# EasyEDA Pro project ProPrj_MambaQuad_2026-02-09.epro, schematic Schematic2

## Sheets
1 ESP32: Board Name: MambaRC V1; Create Date: 2026-01-17; Page Name: ESP32; Project Name: MambaQuad; Schematic Name: Schematic2; Update Date: 2026-01-26; BladeWidth: 10; Company: 嘉立创EDA; Page Size: A4; RegionStart: 1; ShowBorder: 1; TitleBlock: 1; TitleBlockPosition: 3; Version: V1.0; XRegionCount: 6; YRegionCount: 4
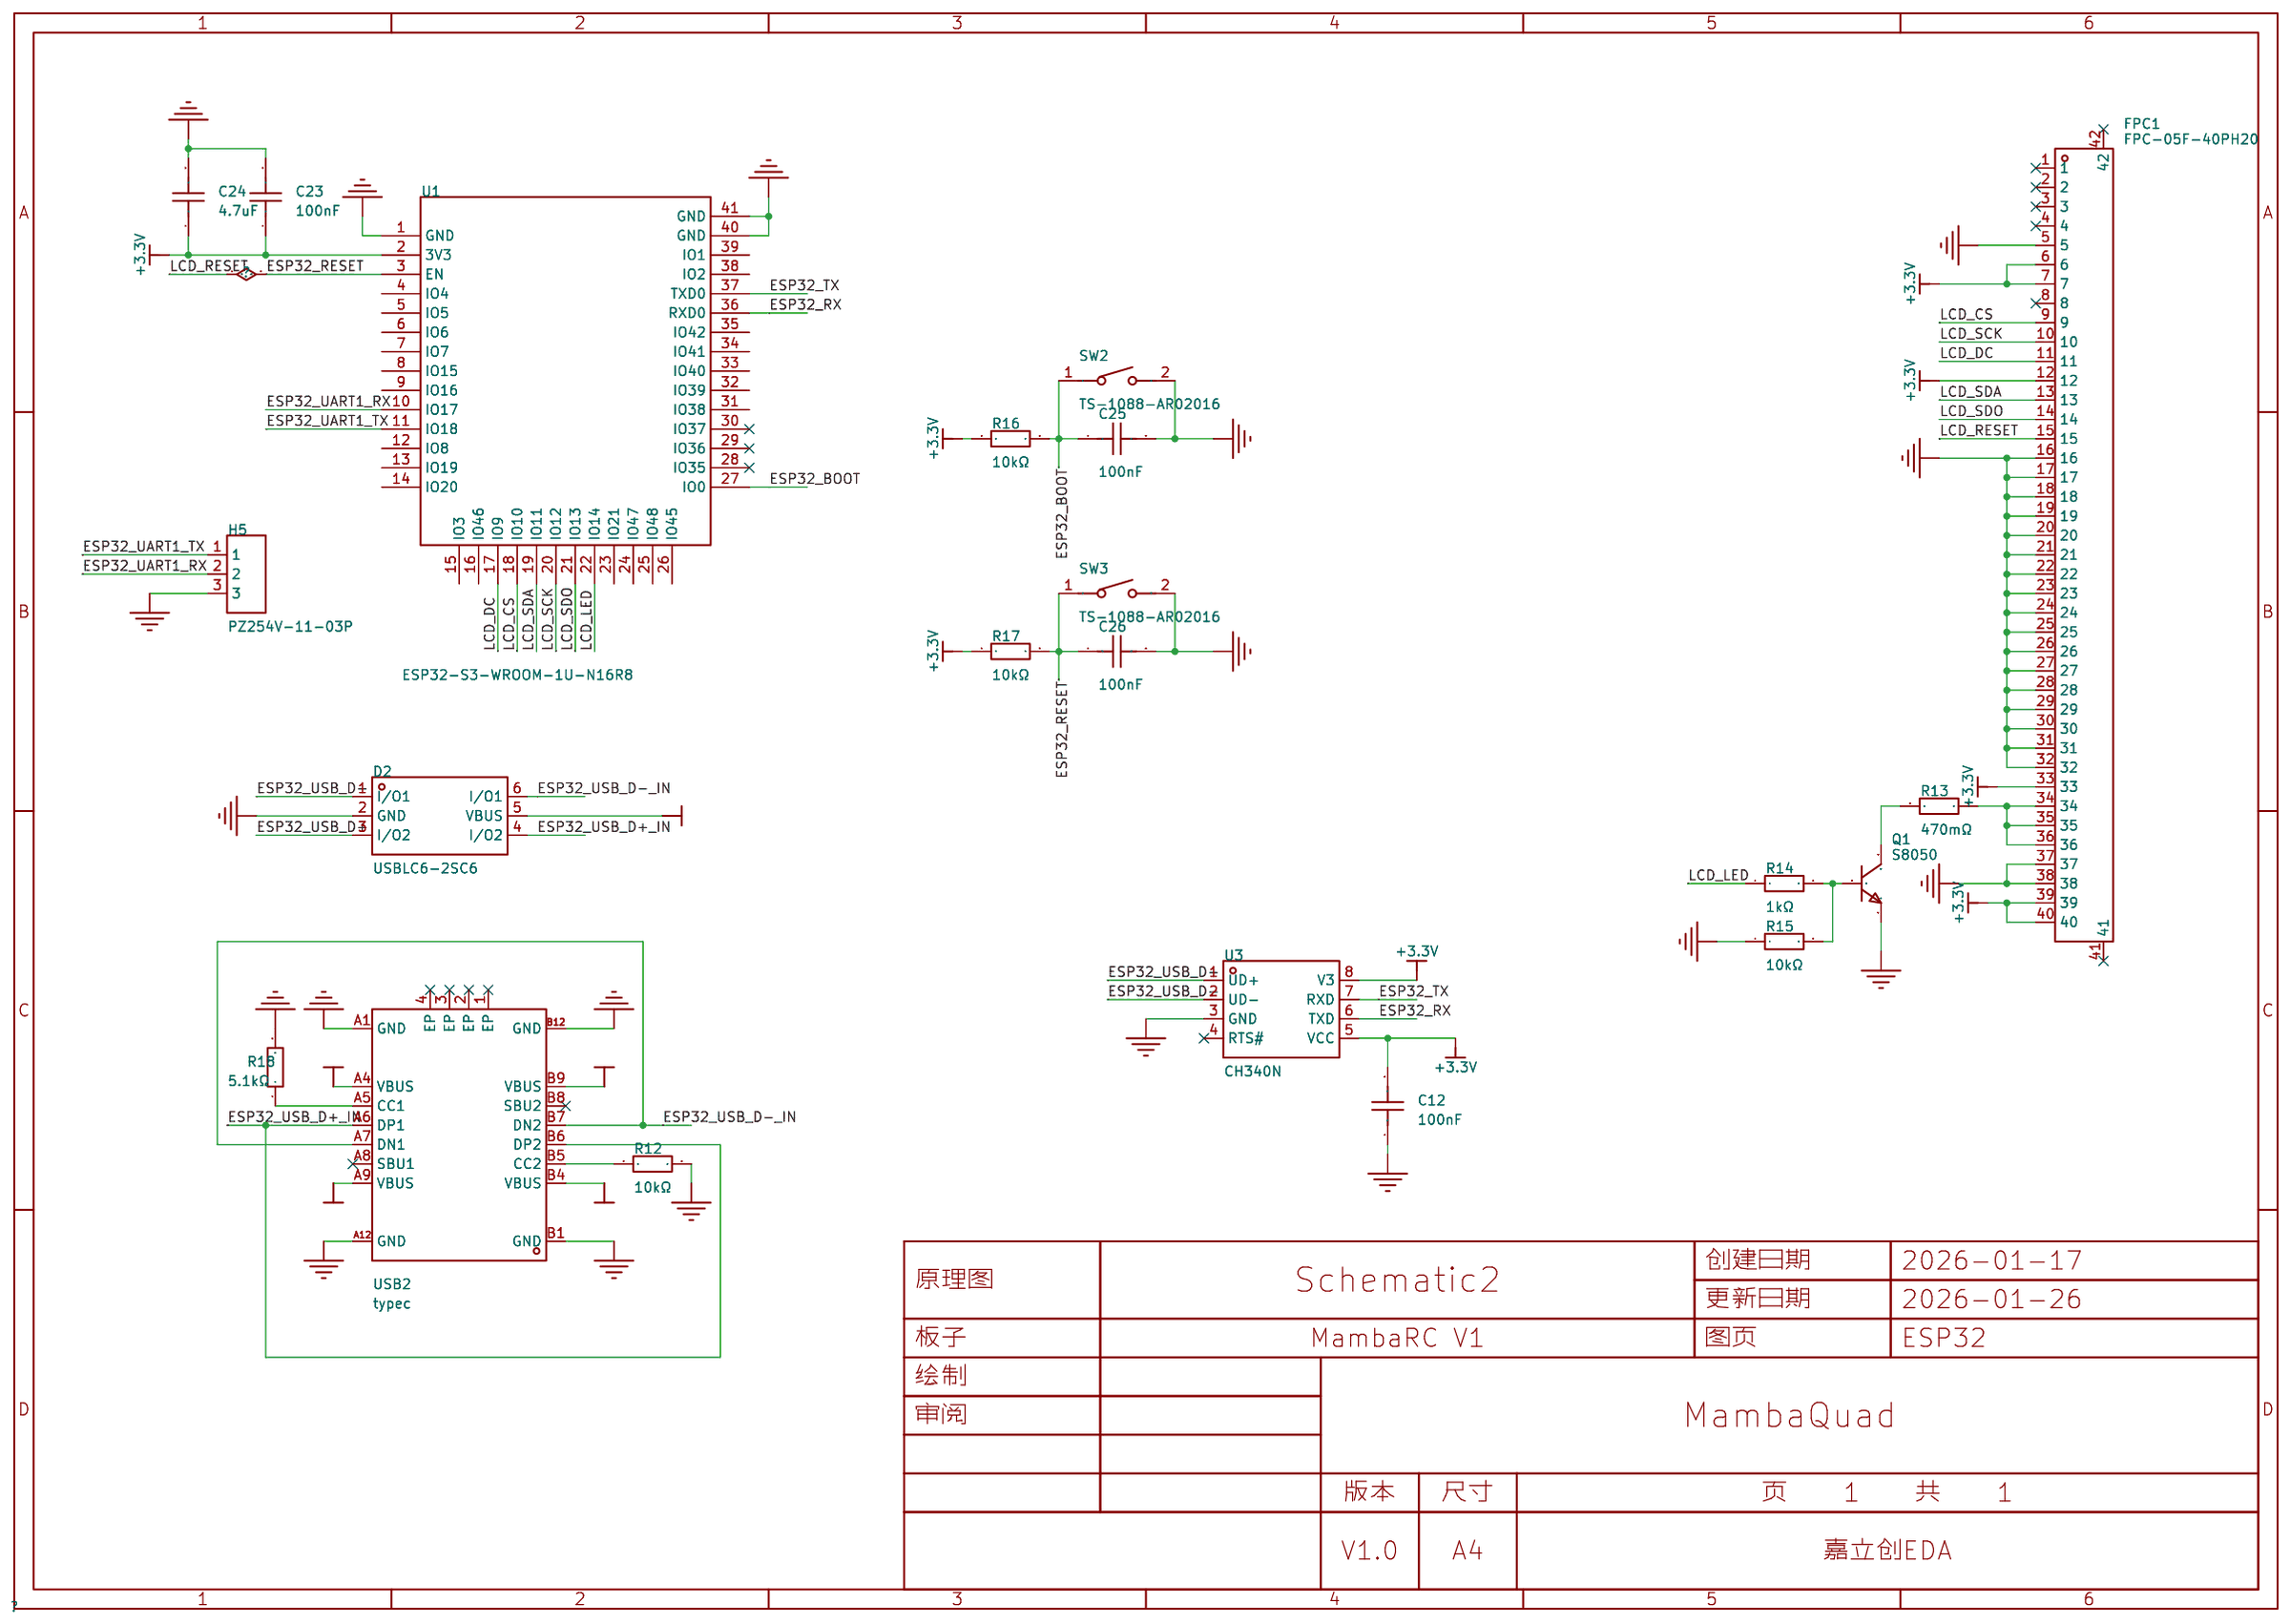
[diagram p0: ESP32]
2 Button: Assembly Variant: Basic; Board Name: Board1; Page Name: P1; Project Name: ManbaController; Schematic Name: Schematic1; Update Date: 2026-01-17
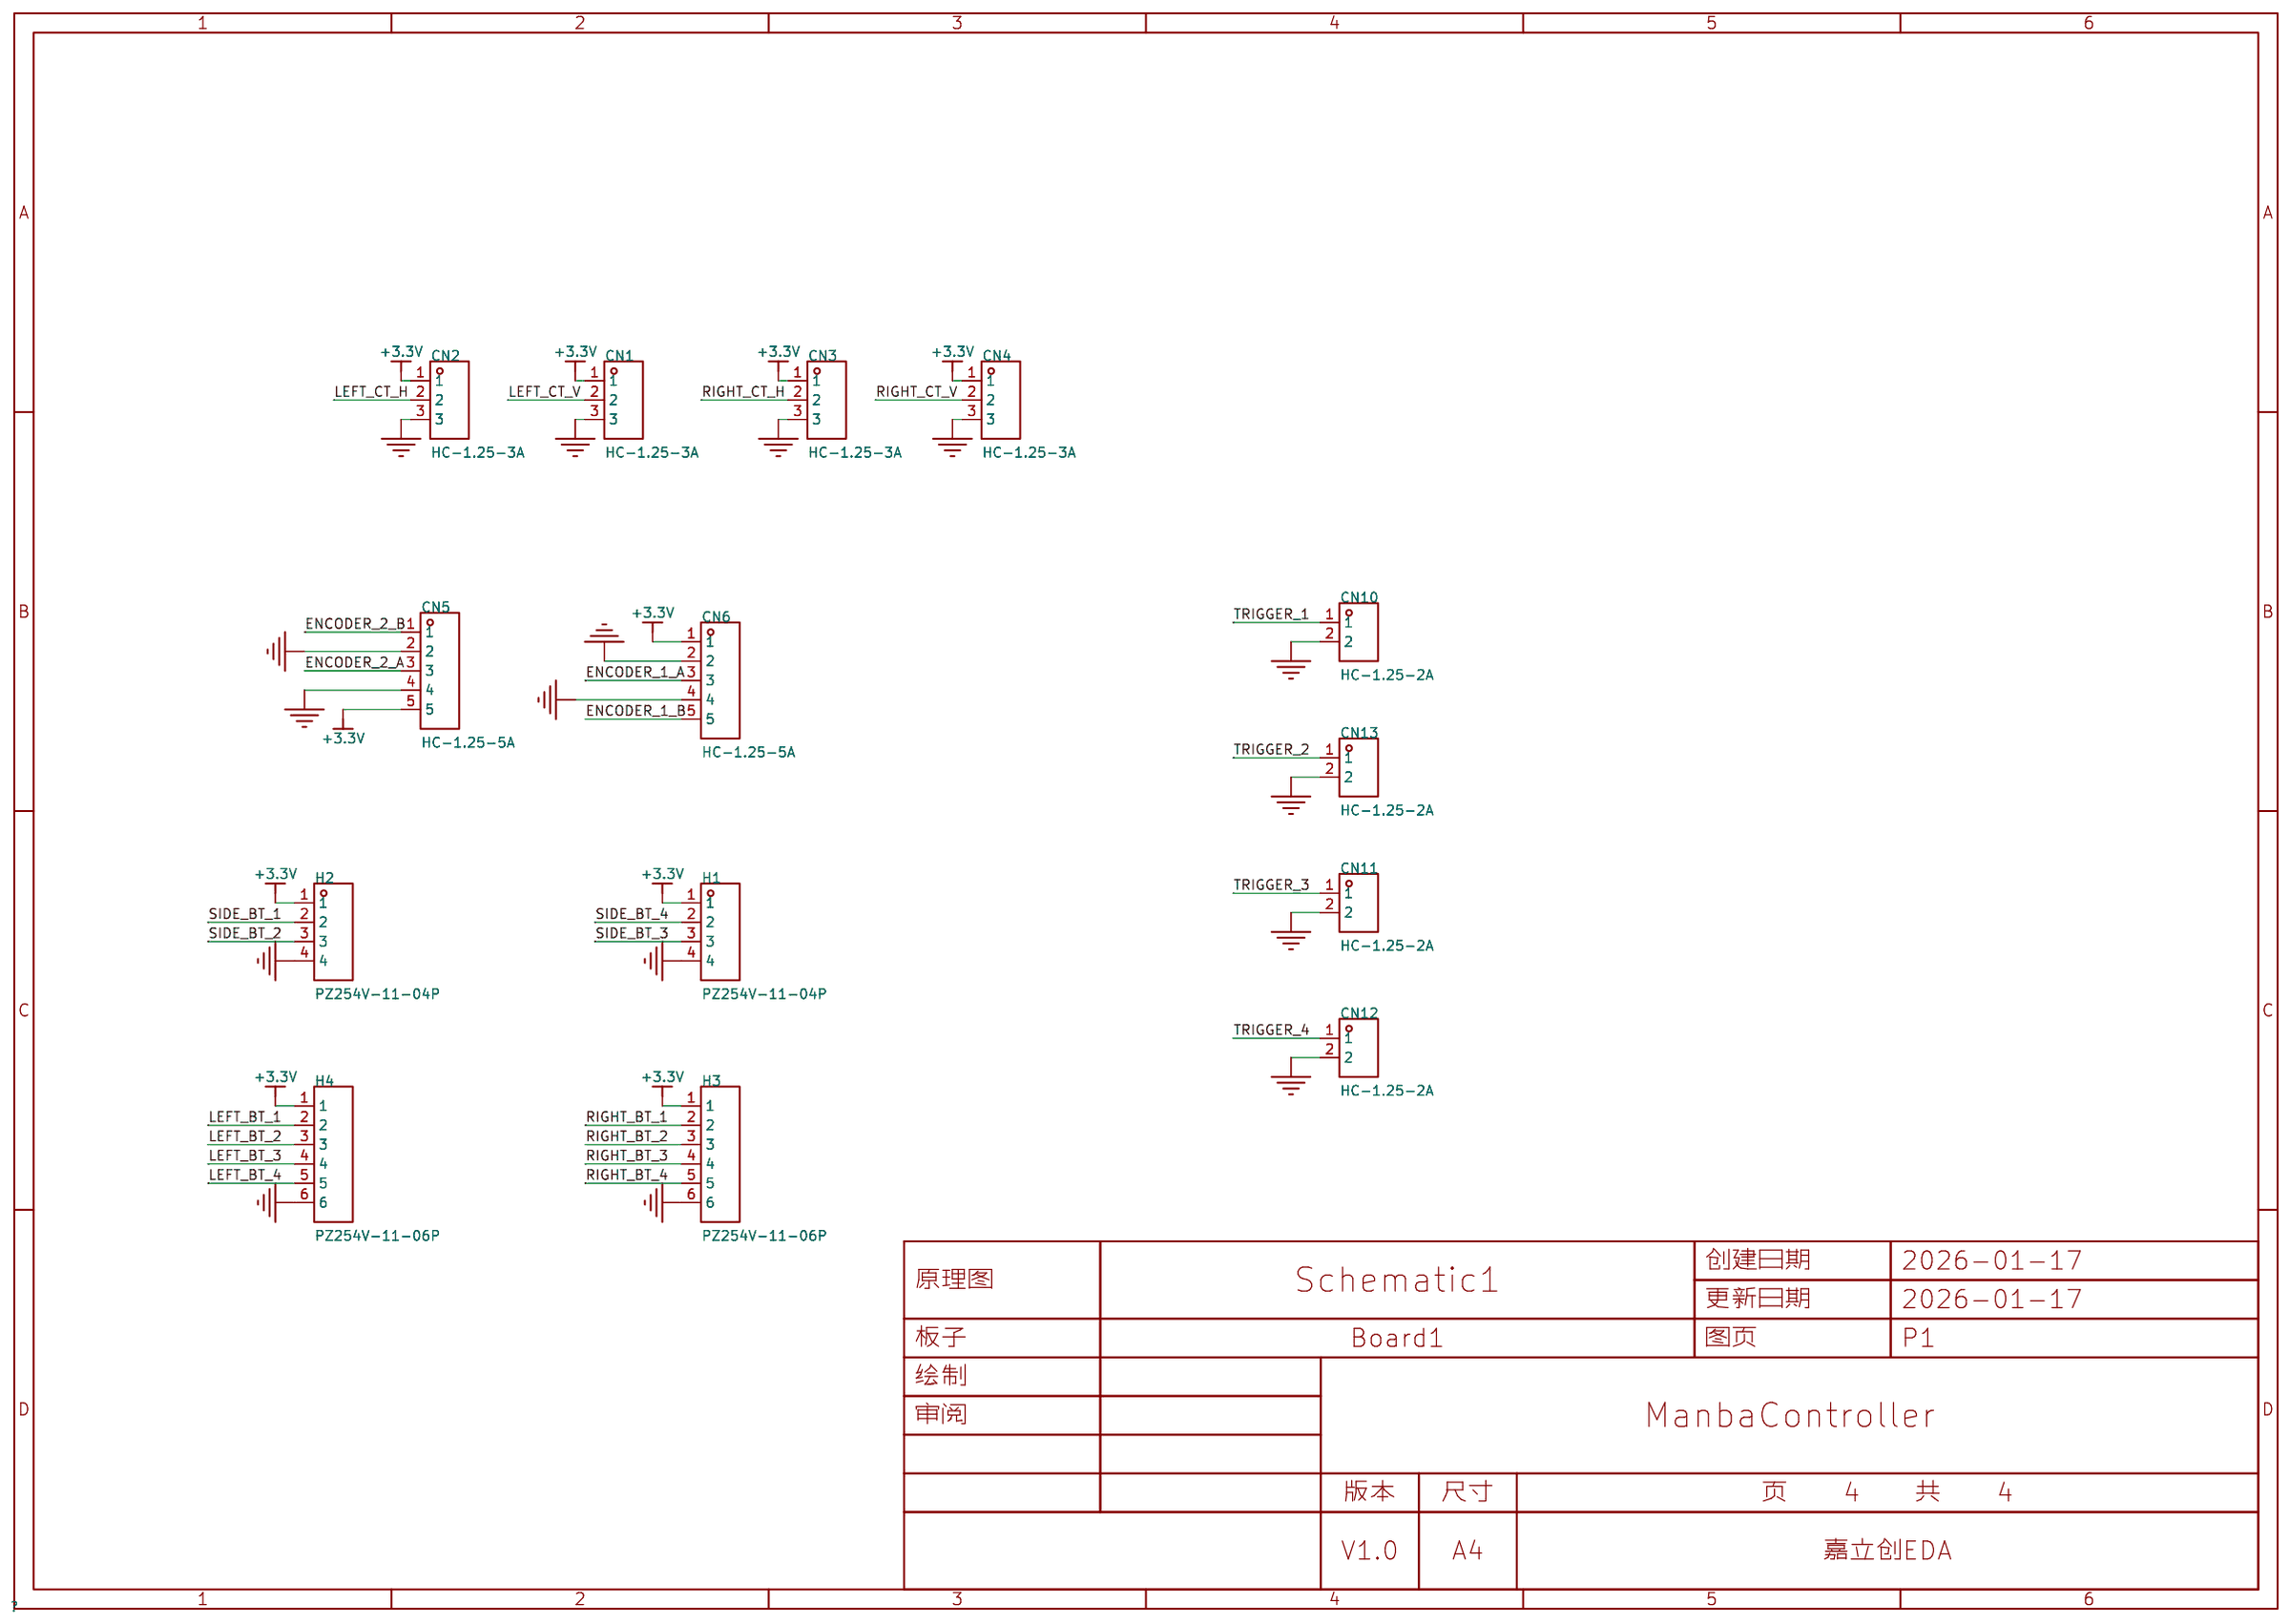
[diagram p1: Button]
3 Sensor: Assembly Variant: Basic; Board Name: Board1; Page Name: P1; Project Name: ManbaController; Schematic Name: Schematic1; Update Date: 2026-01-17
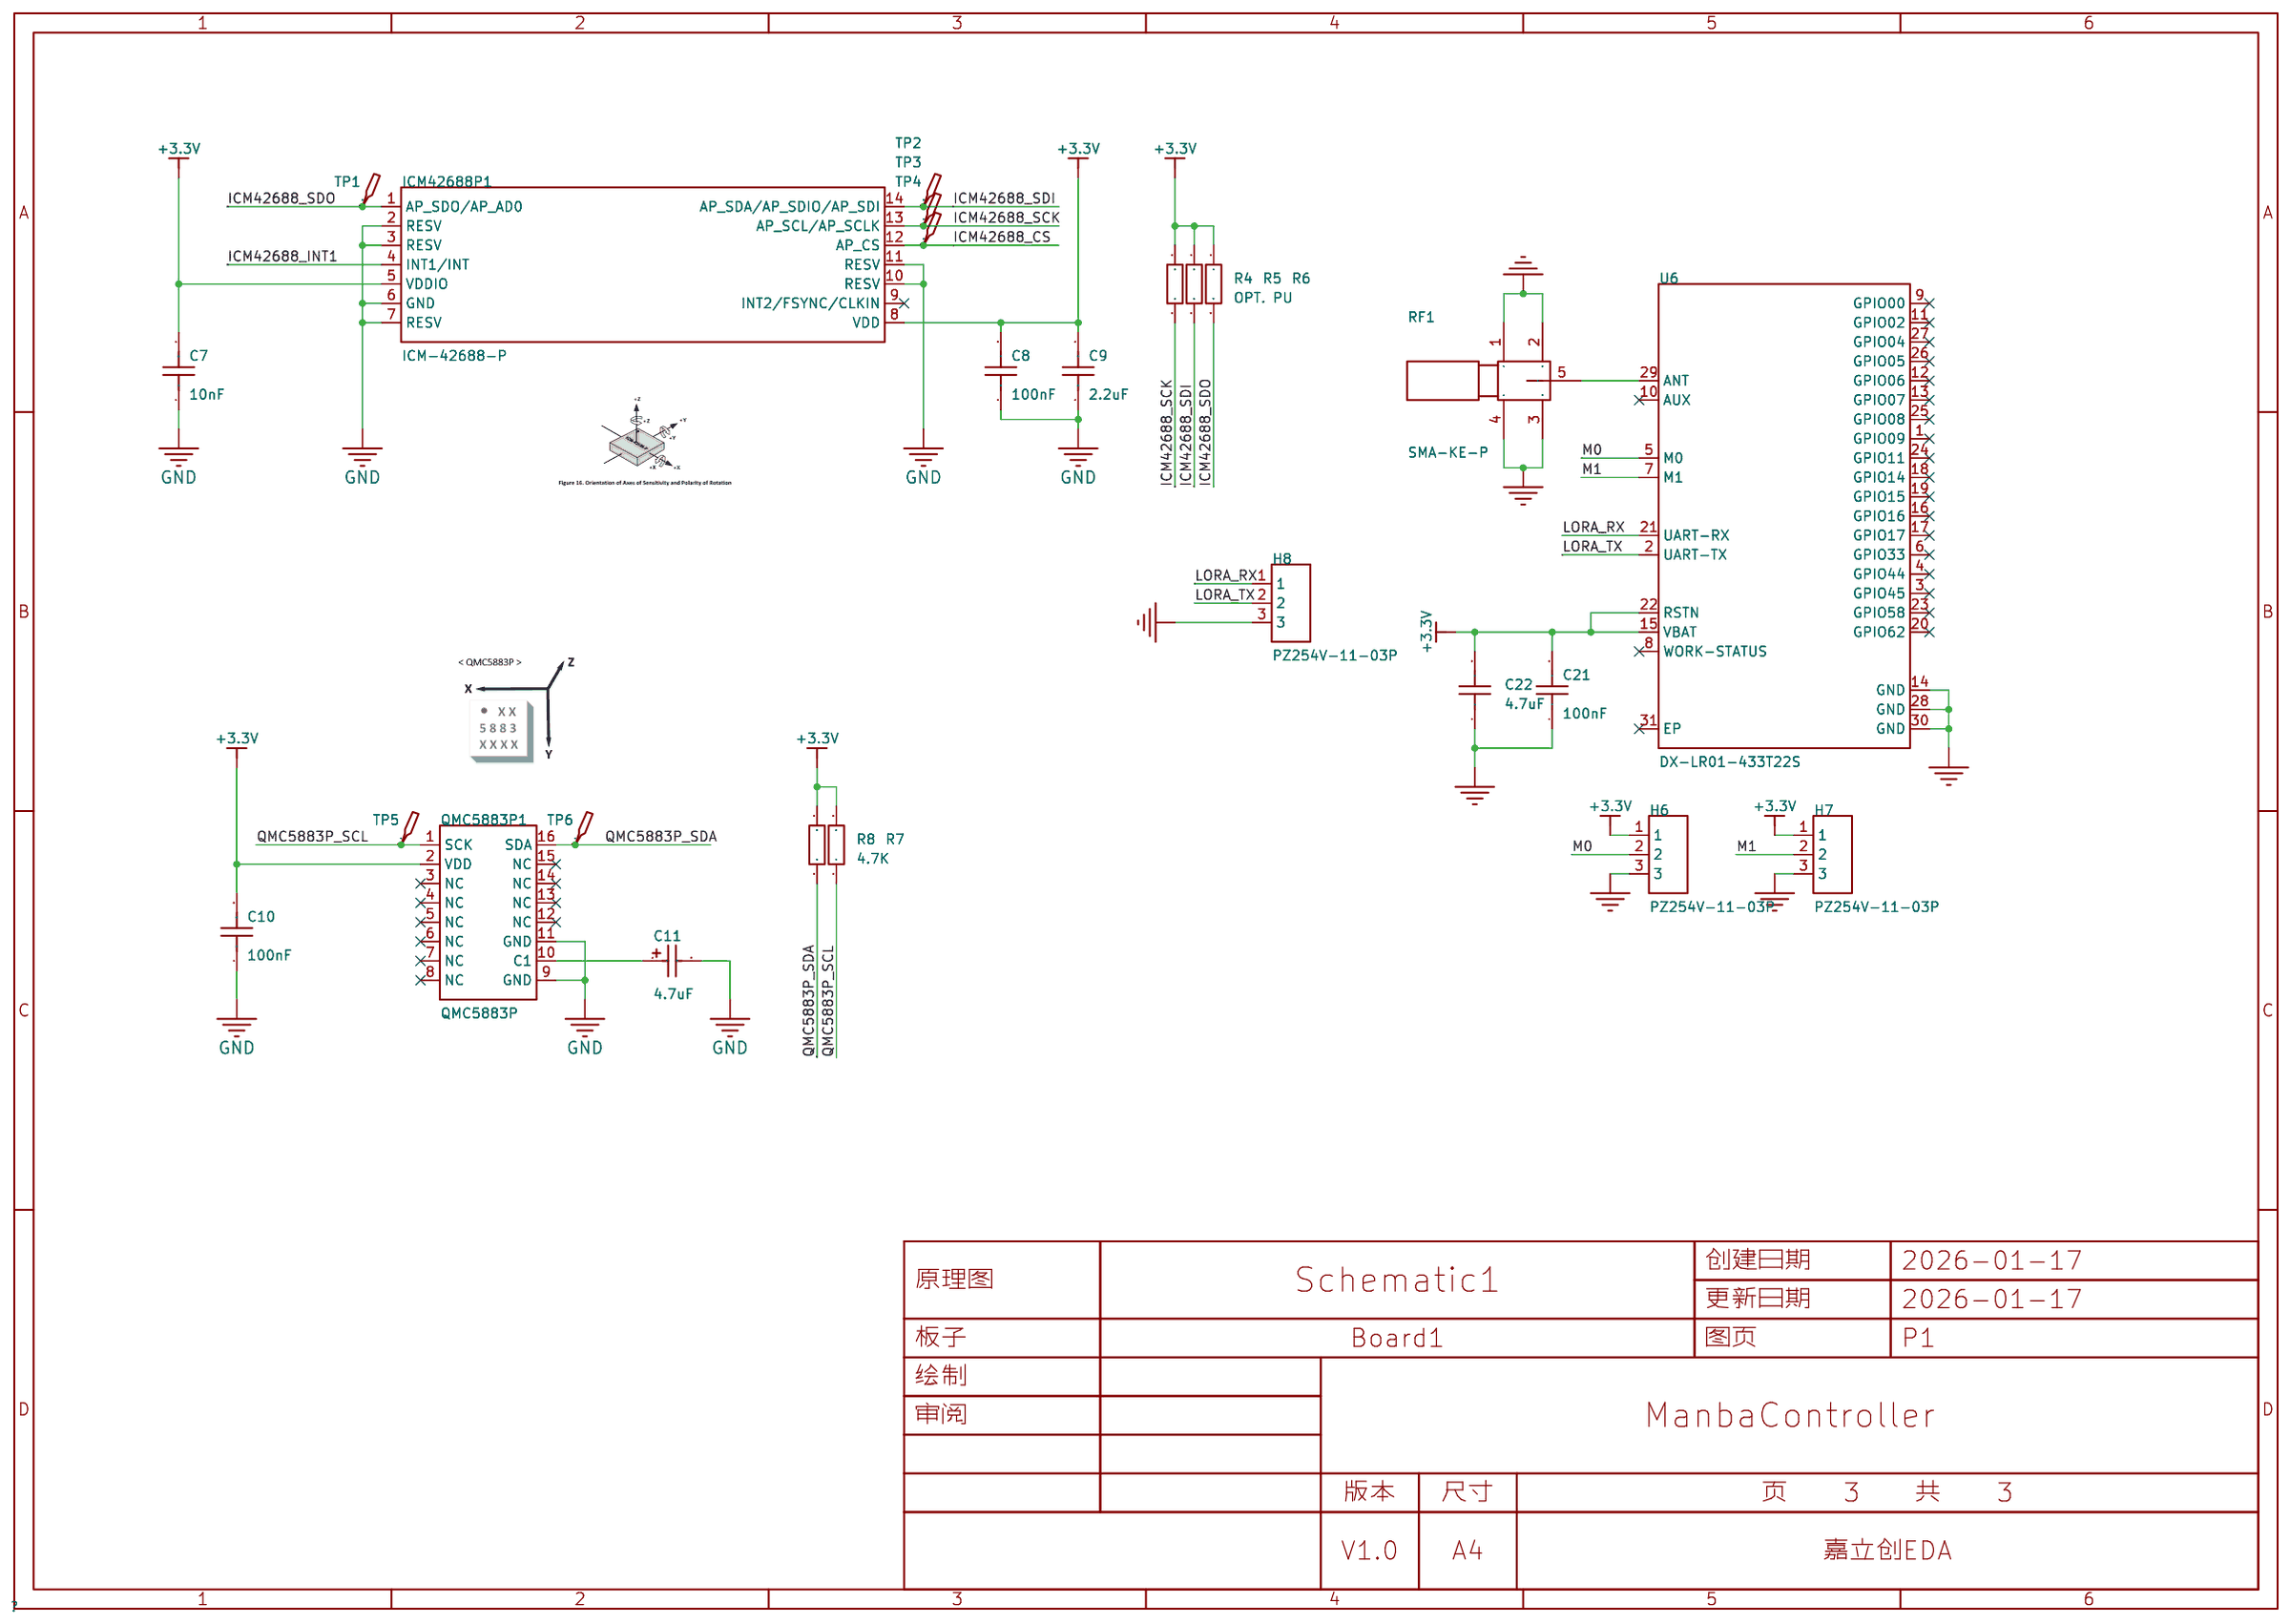
[diagram p2: Sensor]
4 GPS: Assembly Variant: Basic; Board Name: 主控; Create Date: 2026-01-19; Page Name: P1; Project Name: ManbaController; Schematic Name: Schematic1; Update Date: 2026-01-19
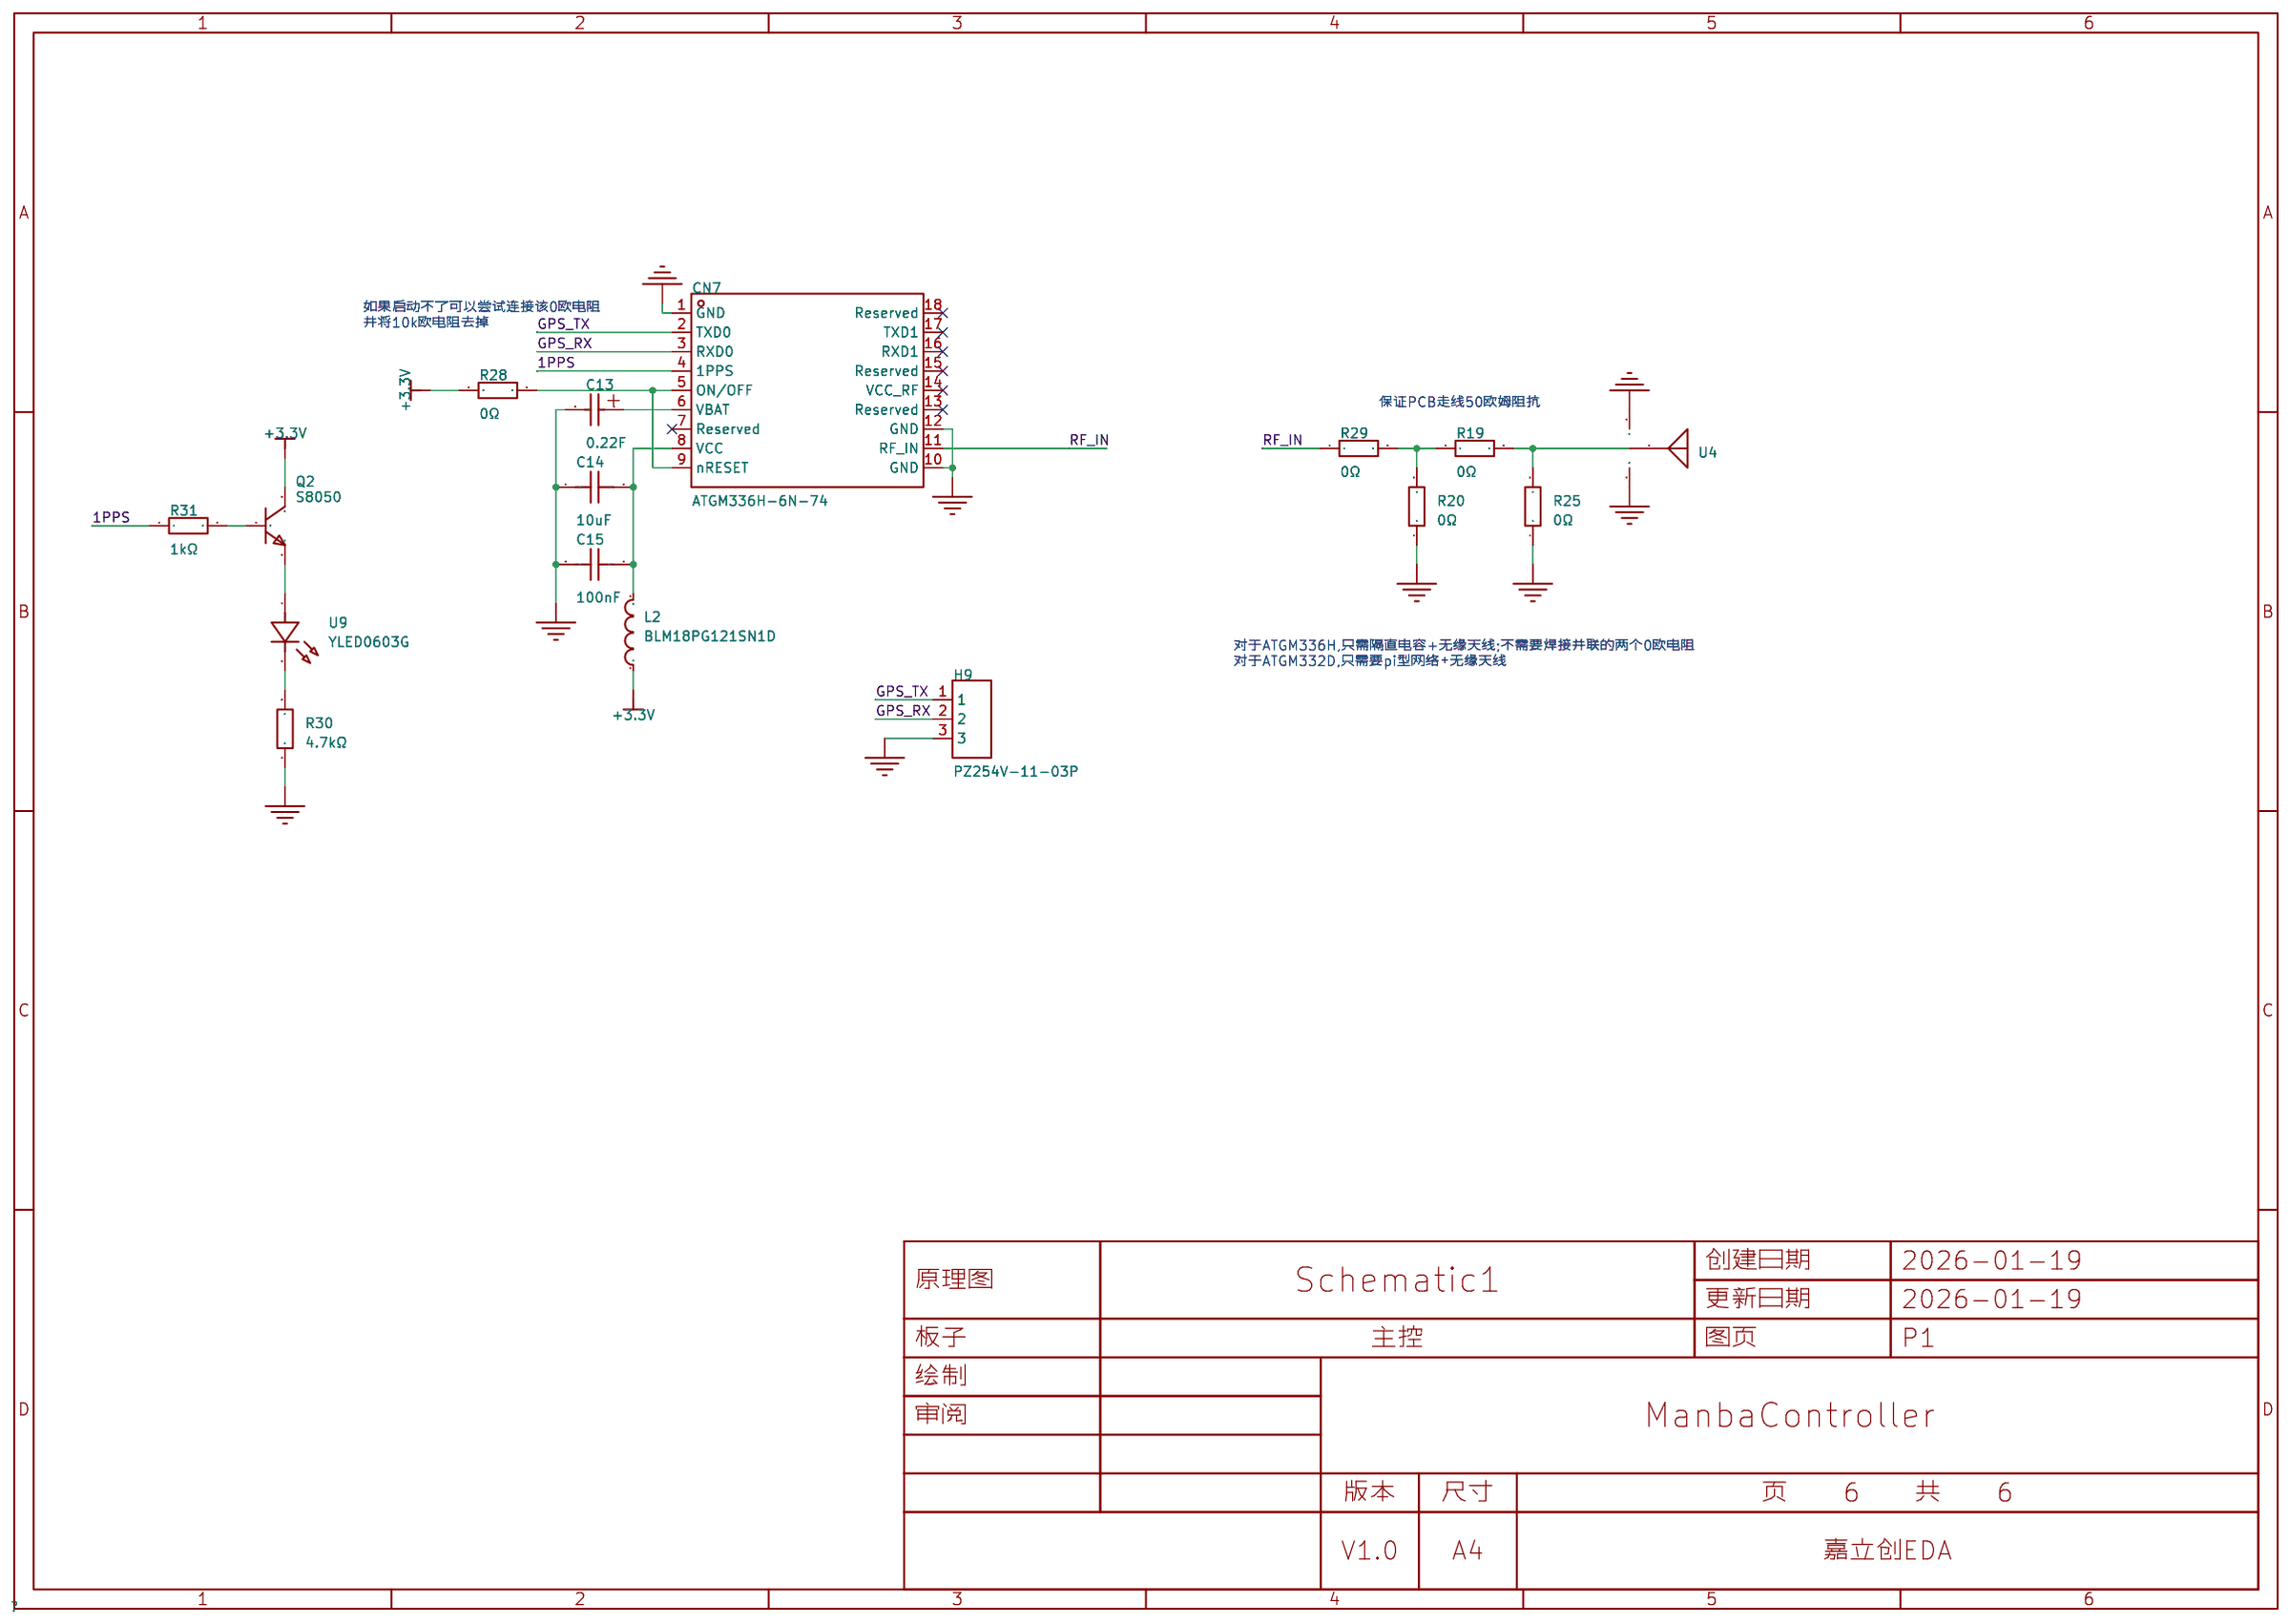
[diagram p3: GPS]
5 Power: Assembly Variant: Basic; Board Name: Board1; Page Name: P1; Project Name: ManbaController; Schematic Name: Schematic1; Update Date: 2026-01-17
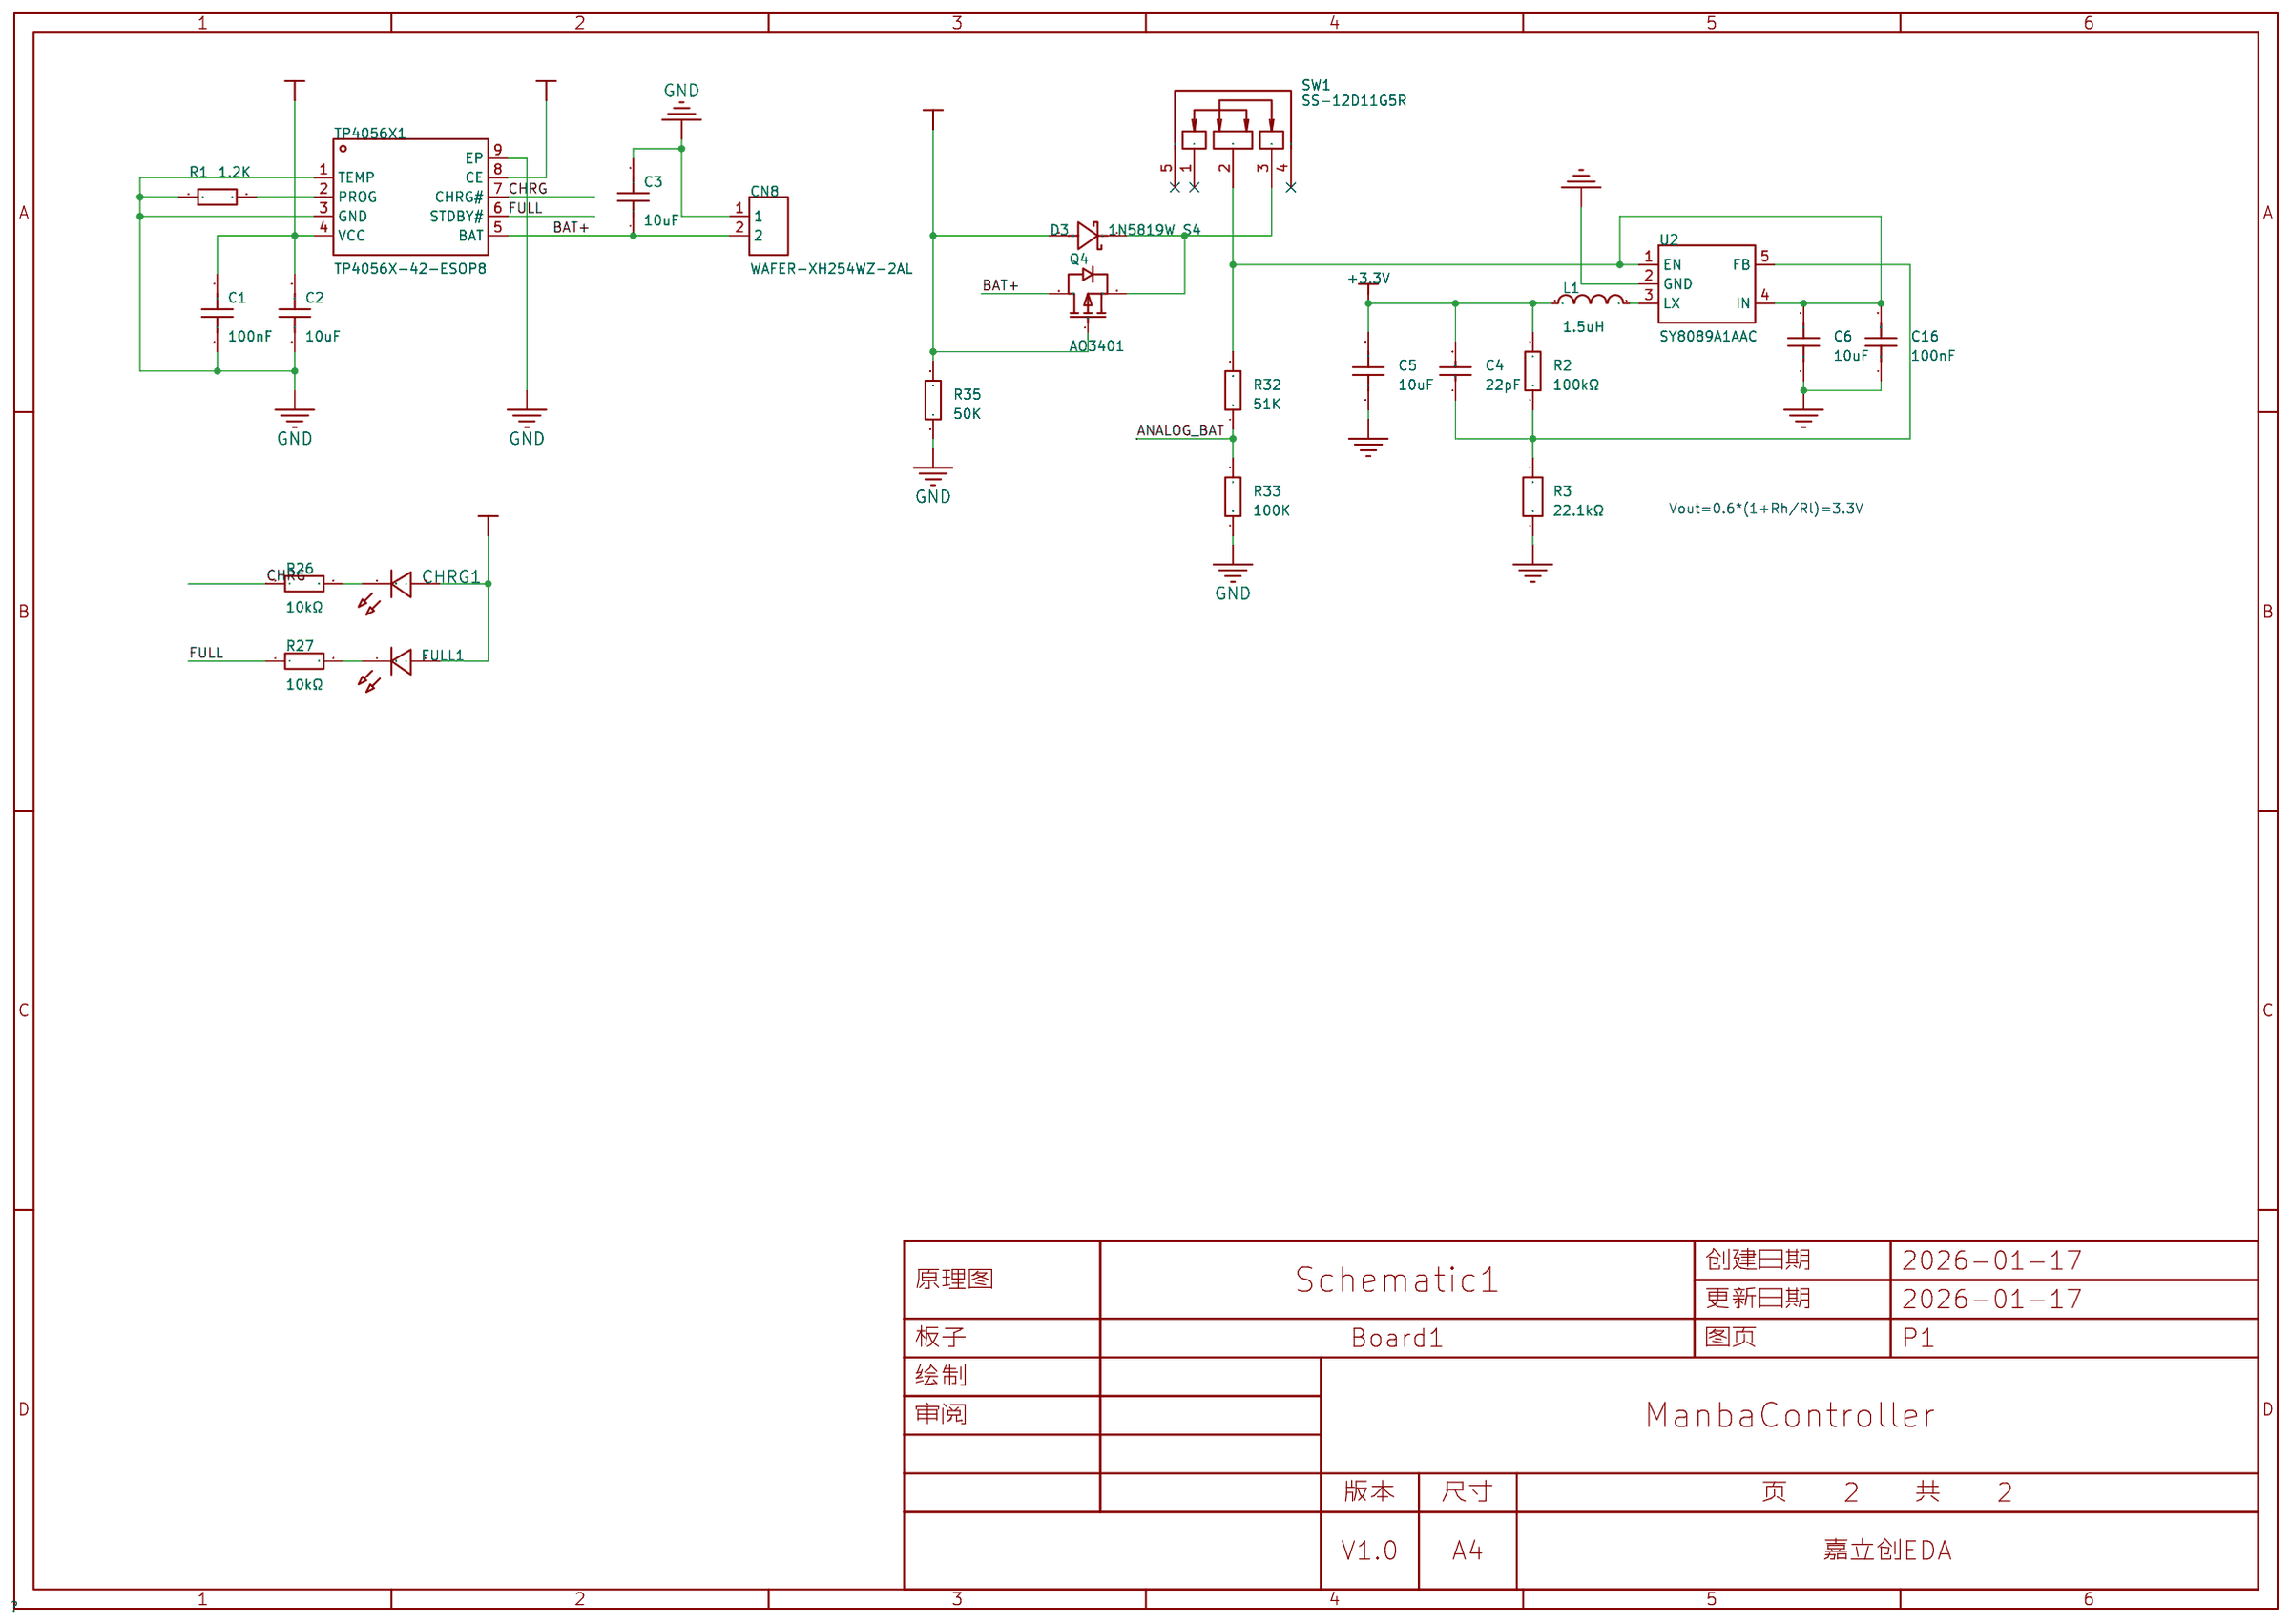
[diagram p4: Power]
6 STM32F103RCT6: Assembly Variant: Basic; Board Name: 主控; Page Name: P1; Project Name: ManbaController; Schematic Name: Schematic1; Update Date: 2026-01-17
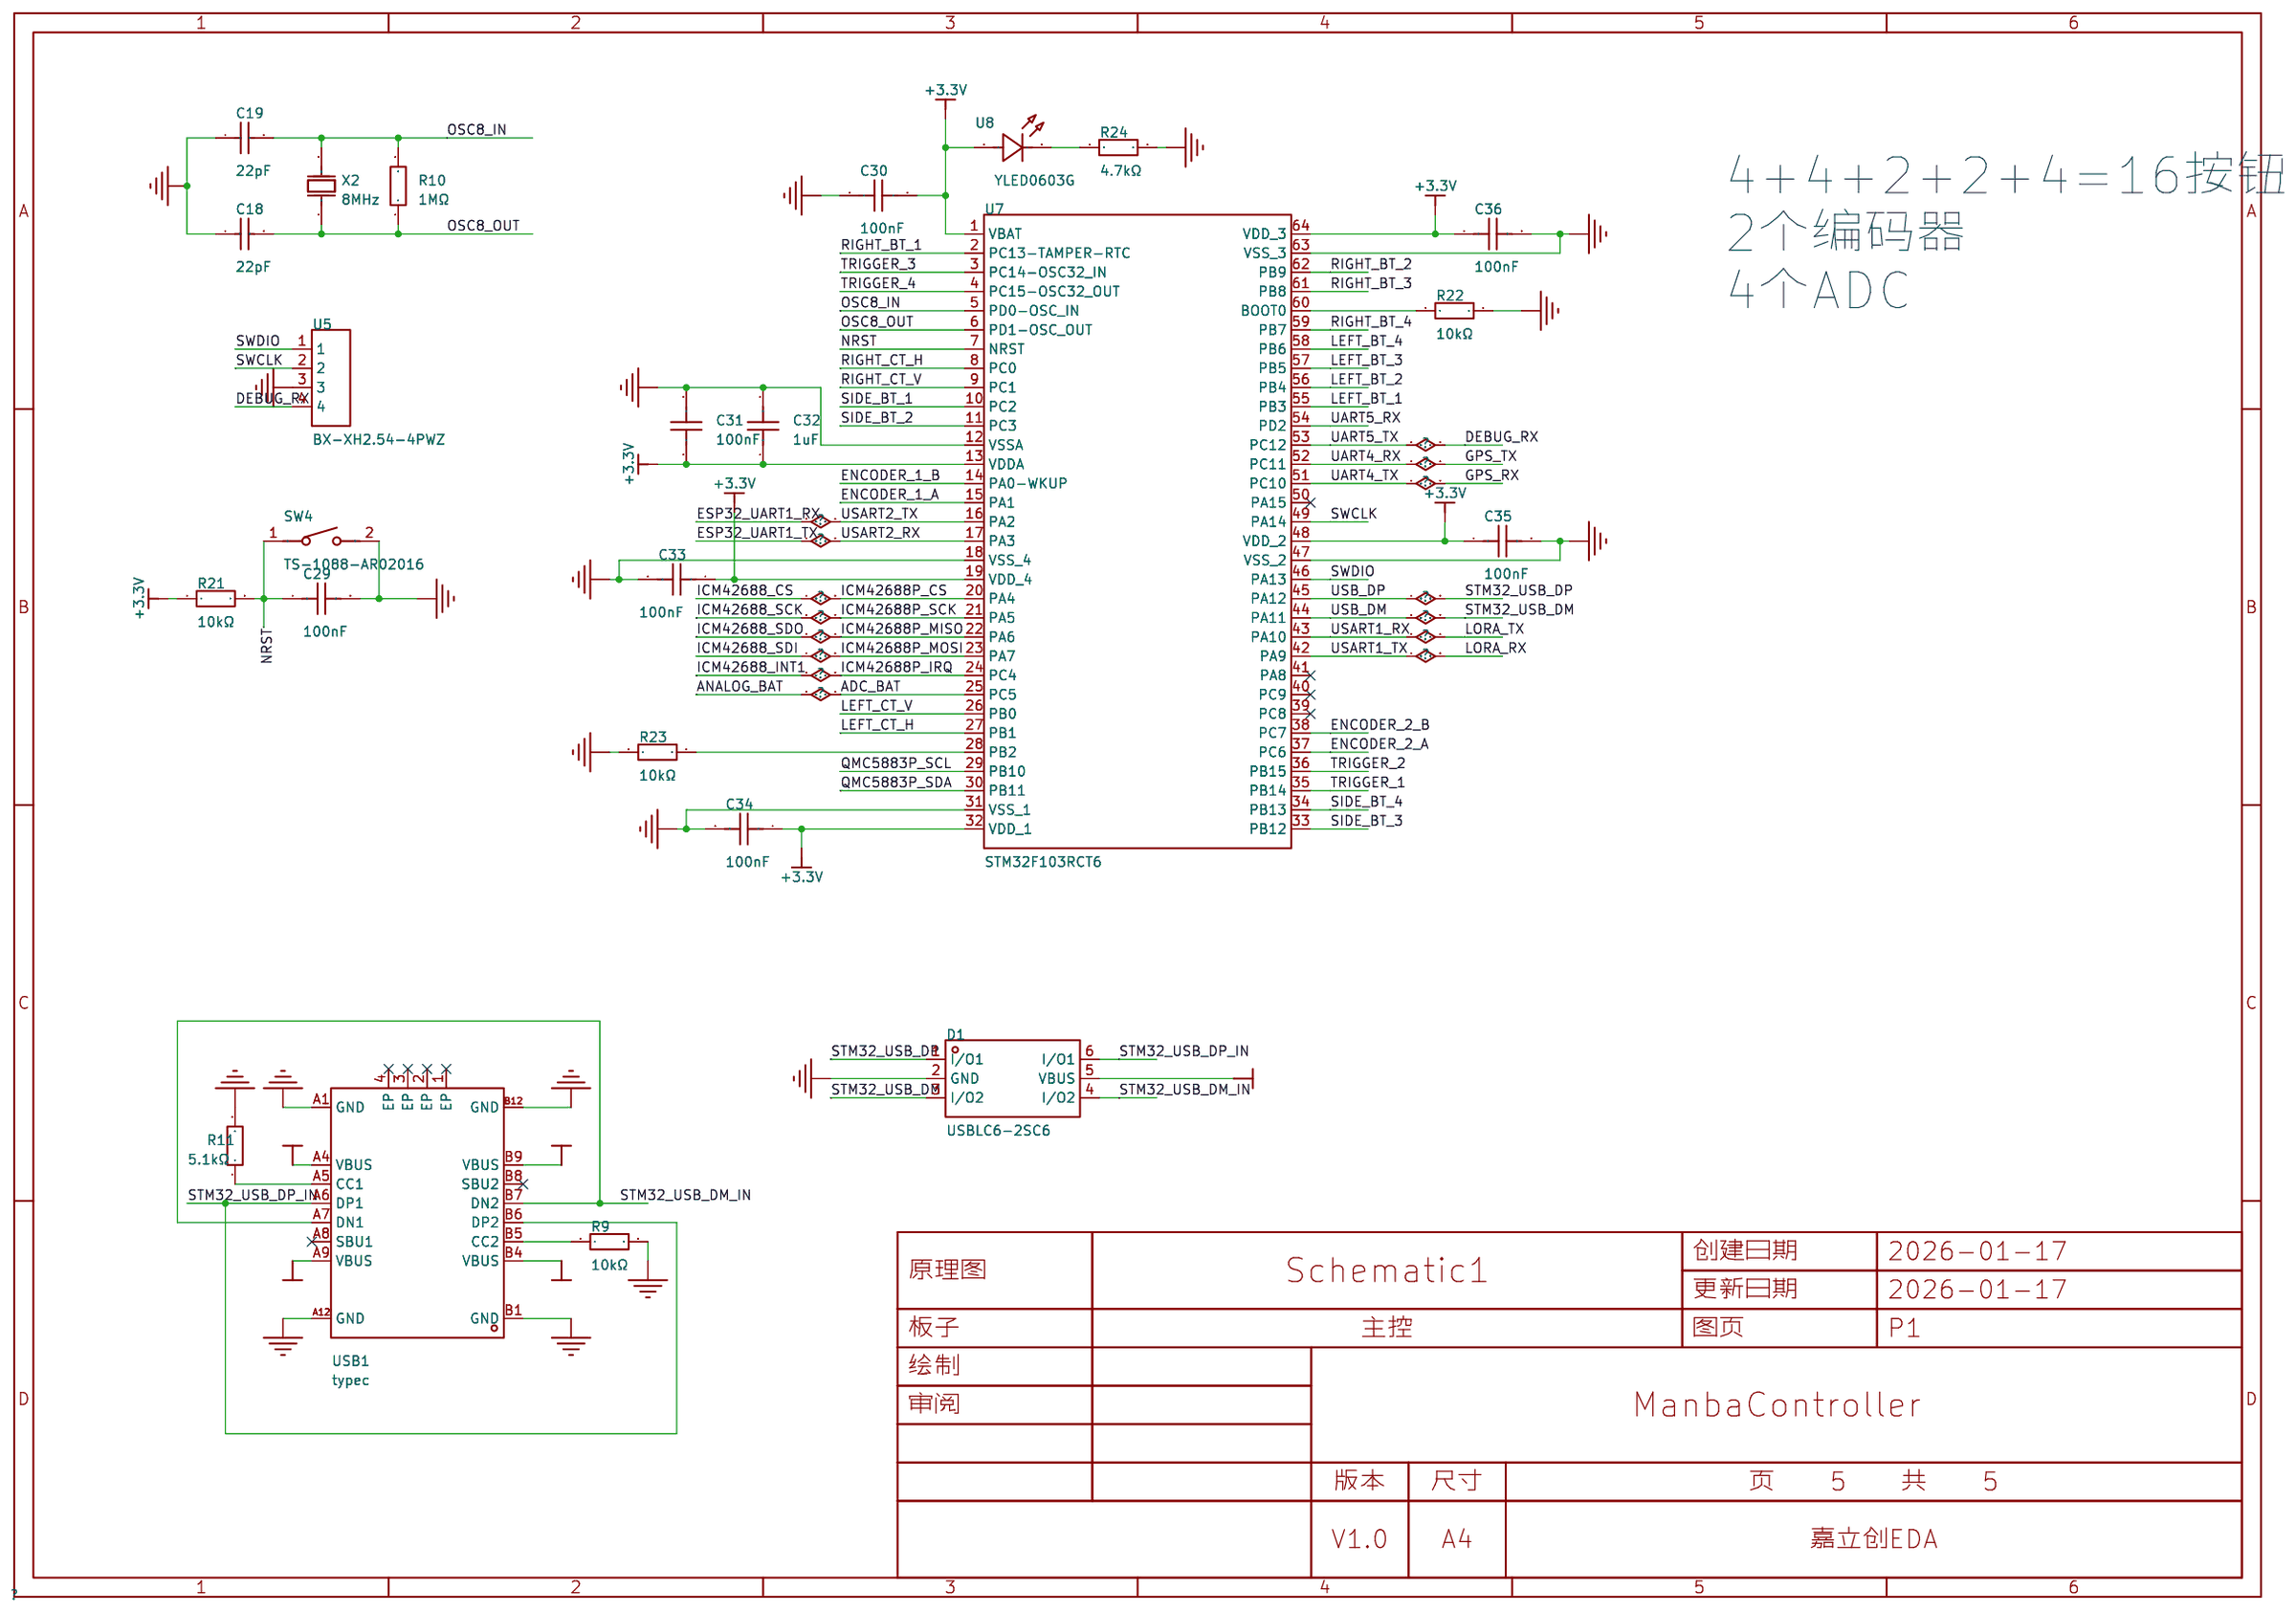
[diagram p5: STM32F103RCT6]

## Parts
sheet Button
CN1  HC-1.25-3A  [CONN-TH_3P-P1.25_HCTL_HC-1.25-3A]
CN2  HC-1.25-3A  [CONN-TH_3P-P1.25_HCTL_HC-1.25-3A]
CN3  HC-1.25-3A  [CONN-TH_3P-P1.25_HCTL_HC-1.25-3A]
CN4  HC-1.25-3A  [CONN-TH_3P-P1.25_HCTL_HC-1.25-3A]
CN5  HC-1.25-5A  [CONN-TH_5P-P1.25_HCTL_HC-1.25-5A]
CN6  HC-1.25-5A  [CONN-TH_5P-P1.25_HCTL_HC-1.25-5A]
CN10  HC-1.25-2A  [CONN-TH_2P-P1.25_HCTL_HC-1.25-2A]
CN11  HC-1.25-2A  [CONN-TH_2P-P1.25_HCTL_HC-1.25-2A]
CN12  HC-1.25-2A  [CONN-TH_2P-P1.25_HCTL_HC-1.25-2A]
CN13  HC-1.25-2A  [CONN-TH_2P-P1.25_HCTL_HC-1.25-2A]
H1  PZ254V-11-04P  [HDR-TH_4P-P2.54-V-M]
H2  PZ254V-11-04P  [HDR-TH_4P-P2.54-V-M]
H3  PZ254V-11-06P  [HDR-TH_6P-P2.54-V-M]
H4  PZ254V-11-06P  [HDR-TH_6P-P2.54-V-M]
sheet ESP32
C12  100nF  [C0603_1]
C23  100nF  [C0603_1]
C24  4.7uF  [C0603_1]
C25  100nF  [C0603]
C26  100nF  [C0603]
D2  USBLC6-2SC6  [SOT-23-6_L2.9-W1.6-P0.95-LS2.8-BL]
FPC1  FPC-05F-40PH20  [FPC-SMD_40P-P0.50_FPC-05F-40PH20]
H5  PZ254V-11-03P  [HDR-TH_3P-P2.54-V-M_PZ254V-11-03P]
Q1  S8050  [SOT-23-3_L2.9-W1.3-P1.90-LS2.3-BR]
R12  10kΩ  [R0603]
R13  470mΩ  [R0603]
R14  1kΩ  [R0603]
R15  10kΩ  [R0603]
R16  10kΩ  [R0603]
R17  10kΩ  [R0603]
R18  5.1kΩ  [R0603]
SW2  TS-1088-AR02016  [SW-SMD_L3.9-W3.0-P4.45]
SW3  TS-1088-AR02016  [SW-SMD_L3.9-W3.0-P4.45]
U1  ESP32-S3-WROOM-1U-N16R8  [WIRELM-SMD_ESP32-S3-WROOM-1U]
U3  CH340N  [SOP-8_L4.9-W3.9-P1.27-LS6.0-BL_1]
USB2  typec  [USB-C-SMD_KH-TYPE-C-16P]
sheet GPS
C13  0.22F  [CAP-TH_DMS3R3224]
C14  10uF  [C0603_1]
C15  100nF  [C0603_1]
CN7  ATGM336H-6N-74  [COMM-SMD_18P-L10.1-W9.7-P1.1-TL_L76-LB]
H9  PZ254V-11-03P  [HDR-TH_3P-P2.54-V-M_PZ254V-11-03P]
L2  BLM18PG121SN1D  [L0603]
Q2  S8050  [SOT-23-3_L2.9-W1.3-P1.90-LS2.3-BR]
R19  0Ω  [R0603]
R20  0Ω  [R0603]
R25  0Ω  [R0603]
R28  0Ω  [R0603]
R29  0Ω  [R0603]
R30  4.7kΩ  [R0603]
R31  1kΩ  [R0603]
U4  3GHz  [ANT-SMD_3P-L3.0-W2.6]
U9  YLED0603G  [LED0603-FD]
sheet Power
C1  100nF  [C0603]
C2  10uF  [C0603]
C3  10uF  [C0603]
C4  22pF  [C0603_1]
C5  10uF  [C0603_1]
C6  10uF  [C0603_1]
C16  100nF  [C0603_1]
CHRG1  -  [LED0603]
CN8  WAFER-XH254WZ-2AL  [CONN-TH_2P-P2.50_WAFER-XH254WZ-2AL]
D3  1N5819W S4  [SOD-123_L2.7-W1.6-LS3.7-RD]
FULL1  -  [LED0603]
L1  1.5uH  [IND-SMD_L4.4-W4.2]
Q4  AO3401  [SOT-23-3_L2.9-W1.4-P1.90-LS2.6-BR]
R1  1.2K  [R0603]
R2  100kΩ  [R0603]
R3  22.1kΩ  [R0603]
R26  10kΩ  [R0603]
R27  10kΩ  [R0603]
R32  51K  [R0603]
R33  100K  [R0603]
R35  50K  [R0603]
SW1  SS-12D11G5R  [SW-TH_SS-12D11G5R]
TP4056X1  TP4056X-42-ESOP8  [SOP-8_L4.9-W3.9-P1.27-LS6.0-TL-EP]
U2  SY8089A1AAC  [TSOT-23-5_L2.9-W1.6-P0.95-LS2.8-BR]
sheet Sensor
C7  10nF  [C0603]
C8  100nF  [C0603]
C9  2.2uF  [C0603]
C10  100nF  [C0603]
C11  4.7uF  [CASE-A_3216]
C21  100nF  [C0603]
C22  4.7uF  [C0603_1]
H6  PZ254V-11-03P  [HDR-TH_3P-P2.54-V-M_PZ254V-11-03P]
H7  PZ254V-11-03P  [HDR-TH_3P-P2.54-V-M_PZ254V-11-03P]
H8  PZ254V-11-03P  [HDR-TH_3P-P2.54-V-M_PZ254V-11-03P]
ICM42688P1  ICM-42688-P  [LGA-14_L3.0-W2.5-P0.50-TL]
QMC5883P1  QMC5883P  [LGA-16_L3.0-W3.0-P0.50-BL_SQ]
R4  OPT. PU  [R0603]
R5  OPT. PU  [R0603]
R6  OPT. PU  [R0603]
R7  4.7K  [R0603]
R8  4.7K  [R0603]
RF1  SMA-KE-P  [SMA-TH_SMA-KE-P]
TP1  -  [Test-Point-0.5mm]
TP2  -  [Test-Point-0.5mm]
TP3  -  [Test-Point-0.5mm]
TP4  -  [Test-Point-0.5mm]
TP5  -  [Test-Point-0.5mm]
TP6  -  [Test-Point-0.5mm]
U6  DX-LR01-433T22S  [WIRELM-SMD_DX-LR01-433T22S]
sheet STM32F103RCT6
C18  22pF  [C0603]
C19  22pF  [C0603]
C29  100nF  [C0603]
C30  100nF  [C0603]
C31  100nF  [C0603]
C32  1uF  [C0603]
C33  100nF  [C0603]
C34  100nF  [C0603]
C35  100nF  [C0603]
C36  100nF  [C0603]
D1  USBLC6-2SC6  [SOT-23-6_L2.9-W1.6-P0.95-LS2.8-BL]
R9  10kΩ  [R0603]
R10  1MΩ  [R0603]
R11  5.1kΩ  [R0603]
R21  10kΩ  [R0603]
R22  10kΩ  [R0603]
R23  10kΩ  [R0603]
R24  4.7kΩ  [R0603]
SW4  TS-1088-AR02016  [SW-SMD_L3.9-W3.0-P4.45]
U5  BX-XH2.54-4PWZ  [CONN-TH_4P-P2.50_BX-XH2.54-4PWZ]
U7  STM32F103RCT6  [LQFP-64_L10.0-W10.0-P0.50-LS12.0-BL]
U8  YLED0603G  [LED0603-FD]
USB1  typec  [USB-C-SMD_KH-TYPE-C-16P]
X2  8MHz  [CRYSTAL-SMD_L5.0-W3.2]

## Library data of the parts
CN1-CN4 = HC-1.25-3A: 插针结构:1x3P;间距:1.25mm;安装方式:直插;参考系列:PicoBlade(MX 1.25);总PIN数:3P;排数:1;每排PIN数:3;行距:-;额定电流:1A;触头材质:黄铜;触头镀层:锡;工作温度:-25℃~+85℃;; LCSC Part Name: 1x3P 间距:1.25mm 直插 系列:PicoBlade(MX 1.25); Supplier Part: C2845521; Manufacturer: HCTL(华灿天禄); Supplier Footprint: 插件,P=1.25mm; JLCPCB Part Class: Extended Part; Datasheet: https://item.szlcsc.com/datasheet/HC-1.25-3A/3039202.html; Supplier: LCSC; Pins Structure: 1x3P; Pitch: 1.25mm; Mounting Type: 直插; Reference Series: PicoBlade(MX 1.25); Number of Pins: 3P; Number of Rows: 1; Number of PINs Per Row: 3; Current Rating: 1A; Contact Material: 黄铜; Contact Plating: 锡; Operating Temperature: -25℃~+85℃; Voltage Rating: 125V; Plastic Material: PA46; Flame Retardant Rating: UL94V-0; Z-Height of the Board: 4.7mm; X-Length of Bottom Edge on Board (Spacing Line): 5.5mm; Y-Width of Bottom Edge on Board: 3.2mm
CN5 CN6 = HC-1.25-5A: 插针结构:1x5P;间距:1.25mm;安装方式:直插;参考系列:PicoBlade(MX 1.25);总PIN数:5P;排数:1;每排PIN数:5;行距:-;额定电流:1A;触头材质:黄铜;触头镀层:锡;工作温度:-25℃~+85℃;; LCSC Part Name: 1x5P 间距:1.25mm 直插 系列:PicoBlade(MX 1.25); Supplier Part: C2845523; Manufacturer: HCTL(华灿天禄); Supplier Footprint: 插件,P=1.25mm; JLCPCB Part Class: Extended Part; Datasheet: https://item.szlcsc.com/datasheet/HC-1.25-5A/3039204.html; Supplier: LCSC; Pins Structure: 1x5P; Pitch: 1.25mm; Mounting Type: 直插; Reference Series: PicoBlade(MX 1.25); Number of Pins: 5P; Number of Rows: 1; Number of PINs Per Row: 5; Current Rating: 1A; Contact Material: 黄铜; Contact Plating: 锡; Operating Temperature: -25℃~+85℃; Voltage Rating: 125V; Plastic Material: PA46; Flame Retardant Rating: UL94V-0; Z-Height of the Board: 4.7mm; X-Length of Bottom Edge on Board (Spacing Line): 8mm; Y-Width of Bottom Edge on Board: 3.2mm
CN10-CN13 = HC-1.25-2A: 插针结构:1x2P;间距:1.25mm;安装方式:直插;参考系列:PicoBlade(MX 1.25);总PIN数:2P;排数:1;每排PIN数:2;行距:-;额定电流:1A;触头材质:黄铜;触头镀层:锡;工作温度:-25℃~+85℃;; LCSC Part Name: 1x2P 间距:1.25mm 直插 系列:PicoBlade(MX 1.25); Supplier Part: C2845520; Manufacturer: HCTL(华灿天禄); Supplier Footprint: 插件,P=1.25mm; JLCPCB Part Class: Extended Part; Datasheet: https://item.szlcsc.com/datasheet/HC-1.25-2A/3039201.html; Supplier: LCSC; Pins Structure: 1x2P; Pitch: 1.25mm; Mounting Type: 直插; Reference Series: PicoBlade(MX 1.25); Number of Pins: 2P; Number of Rows: 1; Number of PINs Per Row: 2; Current Rating: 1A; Contact Material: 黄铜; Contact Plating: 锡; Operating Temperature: -25℃~+85℃; Voltage Rating: 125V; Plastic Material: PA46; Flame Retardant Rating: UL94V-0; Z-Height of the Board: 4.7mm; X-Length of Bottom Edge on Board (Spacing Line): 4.25mm; Y-Width of Bottom Edge on Board: 3.2mm
H1 H2 = PZ254V-11-04P: 插针结构:1x4P;间距:2.54mm;行距:-;圆针/方针:方针;安装方式:直插;排数:单排;总PIN位数:4P;额定电流:3A;额定电压:250V;配合针长度:6mm;塑高:2.5mm;端接针长度:3mm;触头材质:-;工作温度:-40℃~+105℃;颜色:黑色;; LCSC Part Name: 1x4P 间距:2.54mm 方针 直插; Supplier Part: C2691448; Manufacturer: XFCN(兴飞); Supplier Footprint: 插件,P=2.54mm; JLCPCB Part Class: Extended Part; Datasheet: https://item.szlcsc.com/datasheet/PZ254V-11-04P/2801085.html; Supplier: LCSC; Pin Structure: 1x4P; Pitch: 2.54mm; Circluar Pins/Square Pins: 方针; Mounting Type: 直插; Number of Rows: 单排; Number of Pins: 4P; Current Rating: 3A; Voltage Rating (Max): 250V; Length of Mating Pin: 6mm; Insulation Height: 2.5mm; Length of End Connection Pin: 3mm; Operating Temperature: -40℃~+105℃; Color: 黑色
H3 H4 = PZ254V-11-06P: 插针结构:1x6P;间距:2.54mm;行距:-;圆针/方针:方针;安装方式:直插;排数:单排;总PIN位数:6P;额定电流:-;额定电压:-;配合针长度:6mm;塑高:2.5mm;端接针长度:3mm;触头材质:黄铜;触头镀层:-;工作温度:-40℃~+105℃;颜色:黑色;; LCSC Part Name: 1x6P 间距:2.54mm 方针 直插; Supplier Part: C492405; Manufacturer: XFCN(兴飞); Supplier Footprint: 插件,P=2.54mm; JLCPCB Part Class: Extended Part; Datasheet: https://item.szlcsc.com/datasheet/PZ254V-11-06P/502961.html; Supplier: LCSC; Pin Structure: 1x6P; Pitch: 2.54mm; Circluar Pins/Square Pins: 方针; Mounting Type: 直插; Number of Rows: 单排; Number of Pins: 6P; Length of Mating Pin: 6mm; Insulation Height: 2.5mm; Length of End Connection Pin: 3mm; Contact Material: 黄铜; Operating Temperature: -40℃~+105℃; Color: 黑色
C12 = CGA0603X7R104K500JT: 容值:100nF;精度:±10%;额定电压:50V;温度系数:X7R;; LCSC Part Name: 100nF ±10% 50V; Supplier Part: C6119867; Manufacturer: HRE(芯声); Supplier Footprint: 0603; JLCPCB Part Class: 扩展库; Datasheet: https://atta.szlcsc.com/upload/public/pdf/source/20250103/C44077DA9E7B3EFAE02F22B6D3D1CBC9.pdf; Supplier: LCSC; Tolerance: ±10%; Voltage Rating: 50V; Temperature Coefficient: X7R; Voltage Rated: 50V
C16 C23 = CGA0603X7R104K500JT: 容值:100nF;精度:±10%;额定电压:50V;温度系数:X7R;; LCSC Part Name: 100nF ±10% 50V; Supplier Part: C6119867; Manufacturer: HRE(芯声); Supplier Footprint: 0603; JLCPCB Part Class: Extended Part; Datasheet: https://item.szlcsc.com/datasheet/CGA0603X7R104K500JT/7062573.html; Supplier: LCSC; Tolerance: ±10%; Voltage Rating: 50V; Temperature Coefficient: X7R
C22 C24 = CL10A475KO8NNNC: 容值:4.7uF;精度:±10%;额定电压:16V;温度系数:X5R;; LCSC Part Name: 4.7uF ±10% 16V; Supplier Part: C19666; Manufacturer: SAMSUNG(三星); Supplier Footprint: 0603; JLCPCB Part Class: Basic Part; Datasheet: https://item.szlcsc.com/datasheet/CL10A475KO8NNNC/20375.html; Supplier: LCSC; Tolerance: ±10%; Voltage Rating: 16V; Temperature Coefficient: X5R
C25 C26 C29-C31 C33-C36 = CC0603KRX7R9BB104: 容值:100nF;精度:±10%;额定电压:50V;材质(温度系数):X7R;; LCSC Part Name: 100nF ±10% 50V; Supplier Part: C14663; Manufacturer: YAGEO(国巨); Supplier Footprint: 0603; JLCPCB Part Class: 基础库; Datasheet: https://atta.szlcsc.com/upload/public/pdf/source/20180910/C282072_33301C7F631E79921B82A8DAC6BCC5B3.pdf; Supplier: LCSC; Tolerance: ±10%; Voltage Rated: 50V; Temperature Coefficient: X7R
D1 D2 = USBLC6-2SC6: 最大钳位电压:15V;击穿电压:6V;; Supplier Part: C2687116; Manufacturer: UMW(友台半导体); Supplier Footprint: SOT-23-6; JLCPCB Part Class: Extended Part; Datasheet: https://atta.szlcsc.com/upload/public/pdf/source/20231109/512642D850D9873E7C519F71E85B9A10.pdf; Supplier: LCSC; Maximum Clamping Voltage: 15V; Breakdown Voltage: 6V; Number of Lines: 双路; Type: ESD
FPC1 = FPC-05F-40PH20: 锁定特性:翻盖式;触点类型:卧贴;触点数量:40P;间距:0.5mm;安装方式:下接;工作温度:-25℃~+85℃;; LCSC Part Name: 翻盖式 卧贴 P数:40P 间距:0.5mm; Supplier Part: C2856812; Manufacturer: XUNPU(讯普); Supplier Footprint: SMD,P=0.5mm,卧贴; JLCPCB Part Class: Extended Part; Datasheet: https://item.szlcsc.com/datasheet/FPC-05F-40PH20/3056910.html; Supplier: LCSC; Locking Feature: 翻盖式; Contact Type: 卧贴; Number of Contacts: 40P; Pitch: 0.5mm; Mounting Type: 下接; FFC, FCB Thickness: 0.3mm; Height Above Board: 2mm; Contact Material: 磷青铜; Contact Plating: 锡; Operating Temperature: -25℃~+85℃; Rated Voltage (Max): 50V; Current Rating (Max): 500mA
H5-H9 = PZ254V-11-03P: 插针结构:1x3P;间距:2.54mm;行距:-;圆针/方针:方针;安装方式:直插;排数:单排;总PIN位数:3P;额定电流:3A;额定电压:250V;配合针长度:6mm;塑高:2.5mm;端接针长度:3mm;工作温度:-40℃~+105℃;颜色:黑色;; LCSC Part Name: 1x3P 间距:2.54mm 方针 直插; Supplier Part: C2937625; Manufacturer: XFCN(兴飞); Supplier Footprint: 插件,P=2.54mm; JLCPCB Part Class: Extended Part; Datasheet: https://item.szlcsc.com/datasheet/PZ254V-11-03P/3293280.html; Supplier: LCSC; Pin Structure: 1x3P; Pitch: 2.54mm; Circluar Pins/Square Pins: 方针; Mounting Type: 直插; Number of Rows: 单排; Number of Pins: 3P; Current Rating: 3A; Voltage Rating (Max): 250V; Length of Mating Pin: 6mm; Insulation Height: 2.5mm; Length of End Connection Pin: 3mm; Operating Temperature: -40℃~+105℃; Color: 黑色
Q1 Q2 = S8050_C20069125: 晶体管类型:NPN;集电极电流(Ic):500mA;集射极击穿电压(Vceo):25V;耗散功率(Pd):300mW;直流电流增益(hFE):120@50mA,1.0V;; LCSC Part Name: hFE:200-350，丝印:J3Y NPN 500mA 25V; Supplier Part: C20069125; Manufacturer: R+O(宏嘉诚); Supplier Footprint: SOT-23; JLCPCB Part Class: Extended Part; Datasheet: https://item.szlcsc.com/datasheet/S8050/21397163.html; Supplier: LCSC; type: NPN; Current - Collector(Ic): 500mA; Collector - Emitter Voltage VCEO: 25V; Pd - Power Dissipation: 300mW; DC Current Gain: 120@50mA,1.0V; Transition frequency(fT): 100MHz; Current - Collector Cutoff: 100nA; Vce Saturation(VCE(sat)): 600mV@500mA,50mA; Operating Temperature: -55℃~+150℃; Emitter-Base Voltage(Vebo): 5V
R9 R12 R16 R17 R21-R23 = 0603WAF1002T5E: 电阻类型:厚膜电阻;阻值:10kΩ;精度:±1%;功率:100mW;最大工作电压:75V;温度系数:±100ppm/℃;; LCSC Part Name: 厚膜电阻 10kΩ ±1% 100mW; Supplier Part: C25804; Manufacturer: UNI-ROYAL(厚声); Supplier Footprint: 0603; JLCPCB Part Class: Basic Part; Datasheet: https://atta.szlcsc.com/upload/public/pdf/source/20200306/C422600_1E6D84923E4A46A82E41ADD87F860B5C.pdf; Supplier: LCSC; Type: 厚膜电阻; Tolerance: ±1%; Power(Watts): 100mW; Voltage-Supply(Max): 75V; Temperature Coefficient: ±100ppm/℃; Operating Temperature: -55℃~+155℃; Overload Voltage (Max): 75V; Operating Temperature Range: -55℃~+155℃
R13 = 0603WAF470LT5E: 电阻类型:厚膜电阻;阻值:470mΩ;精度:±1%;功率:100mW;工作电压:75V;温度系数:±800ppm/℃;; LCSC Part Name: 470mΩ ±1% 100mW 厚膜电阻; Supplier Part: C23411; Manufacturer: UNI-ROYAL(厚声); Supplier Footprint: 0603; JLCPCB Part Class: Extended Part; Datasheet: https://item.szlcsc.com/datasheet/0603WAF470LT5E/24144.html; Supplier: LCSC; Type: 厚膜电阻; Tolerance: ±1%; Power(Watts): 100mW; Voltage-Supply(Max): 75V; Temperature Coefficient: ±800ppm/℃; Operating Temperature: -55℃~+155℃
R14 R31 = 0603WAF1001T5E: 电阻类型:厚膜电阻;阻值:1kΩ;精度:±1%;功率:100mW;最大工作电压:75V;温度系数:±100ppm/℃;; LCSC Part Name: 1kΩ ±1% 100mW 厚膜电阻; Supplier Part: C21190; Manufacturer: UNI-ROYAL(厚声); Supplier Footprint: 0603; JLCPCB Part Class: 基础库; Datasheet: https://atta.szlcsc.com/upload/public/pdf/source/20200306/C422600_1E6D84923E4A46A82E41ADD87F860B5C.pdf; Supplier: LCSC; Type: 厚膜电阻; Tolerance: ±1%; Power(Watts): 100mW; Overload Voltage (Max): 75V; Temperature Coefficient: ±100ppm/℃; Operating Temperature Range: -55℃~+155℃
R15 R26 R27 = 0603WAF1002T5E: 电阻类型:厚膜电阻;阻值:10kΩ;精度:±1%;功率:100mW;工作电压:75V;温度系数:±100ppm/℃;; LCSC Part Name: 厚膜电阻 10kΩ ±1% 100mW; Supplier Part: C25804; Manufacturer: UNI-ROYAL(厚声); Supplier Footprint: 0603; JLCPCB Part Class: Basic Part; Datasheet: https://item.szlcsc.com/datasheet/0603WAF1002T5E/26547.html; Supplier: LCSC; Type: 厚膜电阻; Tolerance: ±1%; Power(Watts): 100mW; Voltage-Supply(Max): 75V; Temperature Coefficient: ±100ppm/℃; Operating Temperature: -55℃~+155℃
R11 R18 = 0603WAF5101T5E: 电阻类型:厚膜电阻;阻值:5.1kΩ;精度:±1%;功率:100mW;最大工作电压:75V;温度系数:±100ppm/℃;; LCSC Part Name: 5.1kΩ ±1% 100mW 厚膜电阻; Supplier Part: C23186; Manufacturer: UNI-ROYAL(厚声); Supplier Footprint: 0603; JLCPCB Part Class: Basic Part; Datasheet: https://atta.szlcsc.com/upload/public/pdf/source/20200306/C422600_1E6D84923E4A46A82E41ADD87F860B5C.pdf; Supplier: LCSC; Type: 厚膜电阻; Tolerance: ±1%; Power(Watts): 100mW; Overload Voltage (Max): 75V; Temperature Coefficient: ±100ppm/℃; Operating Temperature Range: -55℃~+155℃
SW2-SW4 = TS-1088-AR02016: 电路结构:单刀单掷;按钮形状:圆形按钮;作用力:160gf;安装方式:立贴;开关长度:4mm;开关宽度:3mm;开关高度:2mm;带支架:不带;触点电流:50mA;额定电压(DC):12V;绝缘电阻:100MΩ;机械寿命:10万次;; LCSC Part Name: 4*3*2mm 立贴 轻触开关; Supplier Part: C720477; Manufacturer: XUNPU(讯普); Supplier Footprint: SMD; JLCPCB Part Class: 扩展库; Datasheet: https://atta.szlcsc.com/upload/public/pdf/source/20200810/C720475_60D09DD6C54279ADDB2DC25100F1CC11.pdf; Supplier: LCSC; Circuit: 单刀单掷; Actuator Style: 圆形按钮; Operating Force: 160gf; Mounting Style: 立贴; Switch Length: 4mm; Switch Width: 3mm; Switch Height: 2mm; Strike Gundam: 不带; Contact Current: 50mA; Voltage Rating (DC): 12V; Insulation Resistance: 100MΩ; Actuator/Cap Color: 黑色; Pin Style: SMD接片; Mechanical Life: 10万次; Operating Temperature: -30℃~+80℃
U1 = ESP32-S3-WROOM-1U-N16R8: Supplier Part: C3013946; Manufacturer: ESPRESSIF(乐鑫); Supplier Footprint: SMD,19.2x18mm; JLCPCB Part Class: Extended Part; Datasheet: https://item.szlcsc.com/datasheet/ESP32-S3-WROOM-1U-N16R8/3522416.html; Supplier: LCSC
U3 = CH340N: 应用功能:USB转串口;USB协议版本:USB 2.0;通道数:1;数据速率:2Mbps;; LCSC Part Name: USB转串口芯片 CH340; Supplier Part: C2977777; Manufacturer: WCH(南京沁恒); Supplier Footprint: SOP-8; JLCPCB Part Class: Extended Part; Datasheet: https://atta.szlcsc.com/upload/public/pdf/source/20230530/6E401E9554E9F5311886CC8B3F89B62E.pdf; Supplier: LCSC; Applications Function: USB转串口; USB Protocol: USB 2.0; Number of Channels: 1; Voltage - Supply: 3.3V；5V; Data Rate: 2Mbps; Operating Temperature: -20℃~+70℃
USB1 USB2 = typec: Supplier Part: C9900016956; Supplier Footprint: typec 12p; JLCPCB Part Class: 扩展库; Supplier: LCSC
C13 = DMS3R3224RS: 容值:0.22F;精度:-20%~+80%;额定电压:3.3V;漏电流:-;等效串联电阻(ESR):200Ω@1kHz;; LCSC Part Name: 0.22F -20%~+80% 3.3V; Supplier Part: C5110245; Manufacturer: KORCHIP(高奇普); Supplier Footprint: SMD,D6.8xL1.4mm; JLCPCB Part Class: 扩展库; Datasheet: https://atta.szlcsc.com/upload/public/pdf/source/20230629/D1B2554E63F39809F951A38373591E32.pdf; Supplier: LCSC; Tolerance: -20%~+80%; Voltage Rated: 3.3V; Equivalent Series Resistance(ESR): 200Ω@1kHz; Operating Temperature: -10℃~+60℃; Diameter: 6.8mm; Height - Seated(Max): 7.3mm
C14 = CL10A106KP8NNNC: 容值:10uF;精度:±10%;额定电压:10V;温度系数:X5R;; LCSC Part Name: 10uF ±10% 10V; Supplier Part: C19702; Manufacturer: SAMSUNG(三星); Supplier Footprint: 0603; JLCPCB Part Class: 基础库; Datasheet: https://item.szlcsc.com/datasheet/CL10A106KP8NNNC/20411.html; Supplier: LCSC; Tolerance: ±10%; Voltage Rating: 10V; Temperature Coefficient: X5R
C15 = CGA0603X7R104K500JT: 容值:100nF;精度:±10%;额定电压:50V;温度系数:X7R;; LCSC Part Name: 100nF ±10% 50V; Supplier Part: C6119867; Manufacturer: HRE(芯声); Supplier Footprint: 0603; JLCPCB Part Class: 扩展库; Datasheet: https://item.szlcsc.com/datasheet/CGA0603X7R104K500JT/7062573.html; Supplier: LCSC; Tolerance: ±10%; Voltage Rating: 50V; Temperature Coefficient: X7R
CN7 = ATGM336H-6N-74: ATGM336H-6N 系列模块是 10.1x9.7mm 尺寸的高性能 GNSS 全模定位导航模块系列的总称。基于中科微第六代多系统 GNSS SOC 单芯片 AT6668，支持多种卫星导航系统，包括北斗二号和北斗三号(B1I 和 B1C）、GALILEO、GPS/QZSS/SBAS、GLONASS 等，可同时接收卫星信号，实现联合定位、导航与授时。 支持同时接收全系统的卫星信号，基于专有的快速搜星技术，可快速接收大量可见卫星信号，实现快速且准确的定位，可显著改善如城市峡谷等复杂环境下的定位性能；集成高性; Supplier Part: C5804601; Manufacturer: 杭州中科微; Supplier Footprint: SMD,10.1x9.7mm; JLCPCB Part Class: 扩展库; Datasheet: https://item.szlcsc.com/datasheet/ATGM336H-6N-74/6733428.html; Supplier: LCSC
L2 = BLM18PG121SN1D: 阻抗@频率:120Ω@100MHz;误差:±25%;直流电阻(DCR):50mΩ;; LCSC Part Name: 单路 0603磁珠 阻抗120Ω@100MHz; Supplier Part: C14709; Manufacturer: muRata(村田); Supplier Footprint: 0603; JLCPCB Part Class: 基础库; Datasheet: https://item.szlcsc.com/datasheet/BLM18PG121SN1D/15379.html; Supplier: LCSC; Impedance @ Frequency: 120Ω@100MHz; Tolerance: ±25%; DC Resistance(DCR): 50mΩ; Current Rating: 2A; Number of Circuits: 1; Operating Temperature: -55℃~+125℃
R19 R20 R25 R28 R29 = 0603WAF0000T5E: 电阻类型:厚膜电阻;阻值:0Ω;精度:±1%;功率:100mW;工作电压:75V;温度系数:-;; LCSC Part Name: 0Ω ±1% 100mW 厚膜电阻; Supplier Part: C21189; Manufacturer: UNI-ROYAL(厚声); Supplier Footprint: 0603; JLCPCB Part Class: 基础库; Datasheet: https://item.szlcsc.com/datasheet/0603WAF0000T5E/21903.html; Supplier: LCSC; Type: 厚膜电阻; Tolerance: ±1%; Power(Watts): 100mW; Voltage-Supply(Max): 75V; Operating Temperature: -55℃~+155℃
R24 R30 = 0603WAF4701T5E: 电阻类型:厚膜电阻;阻值:4.7kΩ;精度:±1%;功率:100mW;工作电压:75V;温度系数:±100ppm/℃;; LCSC Part Name: 4.7kΩ ±1% 100mW 厚膜电阻; Supplier Part: C23162; Manufacturer: UNI-ROYAL(厚声); Supplier Footprint: 0603; JLCPCB Part Class: 基础库; Datasheet: https://item.szlcsc.com/datasheet/0603WAF4701T5E/23889.html; Supplier: LCSC; Type: 厚膜电阻; Tolerance: ±1%; Power(Watts): 100mW; Voltage-Supply(Max): 75V; Temperature Coefficient: ±100ppm/℃; Operating Temperature: -55℃~+155℃
U4 = IPEX1-TXZ 142: 连接器类型:板端;接口类型:内针;端口数量:1;接口直径:2mm;接口长度/高度:1.25mm;频率:3GHz;射频系列:IPEX;阻抗:-;样式:-;工作温度:-40℃~+90℃;; LCSC Part Name: 内针 IPEX; Supplier Part: C3151745; Manufacturer: SHOU HAN(首韩); Supplier Footprint: SMD; JLCPCB Part Class: 扩展库; Datasheet: https://item.szlcsc.com/datasheet/IPEX1-TXZ%2520142/3712563.html; Supplier: LCSC; Connector Type: 板端; Interface: 内针; Number of Ports: 1; Interface Diameter: 2mm; Interface Length/Height: 1.25mm; RF Series: IPEX; Operating Temperature Range: -40℃~+90℃
U8 U9 = YLED0603G: 发光颜色:翠绿色;正向电压(VF):2.7V~3.2V;功率:-;正向电流:25mA;主波长:510nm~531nm;二极管配置:-;透镜颜色:-;色温:-;发光强度:-;发光角度:-;载带方式:-;工作温度:-40℃~+85℃;; Supplier Part: C19273151; Manufacturer: YONGYUTAI(永裕泰); Supplier Footprint: 0603; JLCPCB Part Class: 扩展库; Datasheet: https://atta.szlcsc.com/upload/public/pdf/source/20231201/6896CD173B7817C61CFF421DECB2B9C4.pdf; Supplier: LCSC; Emitted Color: 翠绿色; Forward Voltage (VF): 2.7V~3.2V; Forward Current: 25mA; Dominant Wavelength: 510nm~531nm; Operating Temperature: -40℃~+85℃
C1-C3 C7-C10 C21 = C0603: Supplier Footprint: 0603
C4 = CL10C220JB8NNNC: 容值:22pF;精度:±5%;额定电压:50V;温度系数:C0G;; LCSC Part Name: 22pF ±5% 50V; Supplier Part: C1653; Manufacturer: SAMSUNG(三星); Supplier Footprint: 0603; JLCPCB Part Class: 基础库; Datasheet: https://item.szlcsc.com/datasheet/CL10C220JB8NNNC/2005.html; Supplier: LCSC; Tolerance: ±5%; Voltage Rating: 50V; Temperature Coefficient: C0G
C5 C6 = CL10A106MQ8NNNC: 容值:10uF;精度:±20%;额定电压:6.3V;温度系数:X5R;; LCSC Part Name: 10uF ±20% 6.3V; Supplier Part: C1691; Manufacturer: SAMSUNG(三星); Supplier Footprint: 0603; JLCPCB Part Class: 扩展库; Datasheet: https://item.szlcsc.com/datasheet/CL10A106MQ8NNNC/2043.html; Supplier: LCSC; Tolerance: ±20%; Voltage Rating: 6.3V; Temperature Coefficient: X5R
CHRG1 = LED0603-ORANGE: Supplier Footprint: 0603
CN8 = WAFER-XH254WZ-2AL: 插针结构:1x2P;间距:2.54mm;安装方式:弯插;参考系列:XH;总PIN数:2P;排数:1;每排PIN数:2;额定电流:3A;触头材质:黄铜;工作温度:-25℃~+85℃;; LCSC Part Name: 1x2P 间距:2.54mm 弯插 系列:XH; Supplier Part: C22751804; Manufacturer: HANBO(汉博); Supplier Footprint: 弯插,P=2.54mm; JLCPCB Part Class: Extended Part; Datasheet: https://item.szlcsc.com/datasheet/WAFER-XH254WZ-2AL/24478739.html; Supplier: LCSC; Pins Structure: 1x2P; Pitch: 2.54mm; Mounting Type: 弯插; Reference Series: XH; Number of Pins: 2P; Number of Rows: 1; Number of PINs Per Row: 2; Current Rating: 3A; Contact Material: 黄铜; Operating Temperature: -25℃~+85℃; Voltage Rating: 250V; Plastic Material: PA66; Flame Retardant Rating: UL94V-0
D3 = 1N5819W S4_1: Supplier Part: C42441798; Manufacturer: TDSEMIC(拓电半导体); Supplier Footprint: SOD-123FL; Datasheet: https://atta.szlcsc.com/upload/public/pdf/source/20250110/C8BCE7F7EDFAC688AB53FBC3883F650D.pdf; Supplier: LCSC
FULL1 = LED0402-GREEN
L1 = FXL0420-1R5-M: 电感值:1.5uH;精度:±20%;额定电流:5A;饱和电流(Isat):6A;类型:一体成型电感;; LCSC Part Name: 1.5uH ±20% 6A; Supplier Part: C167205; Manufacturer: cjiang(长江微电); Supplier Footprint: SMD,4.2x4.4mm; JLCPCB Part Class: 扩展库; Datasheet: https://atta.szlcsc.com/upload/public/pdf/source/20240426/3189EA8206330E2108542F9E34E540E7.pdf; Supplier: LCSC; Tolerance: ±20%; Rated Current: 5A; Saturation Current (Isat): 6A; DC Resistance (DCR): 46mΩ; Type: 一体成型电感
Q4 = AO3401_C727156: 数量:1个P沟道;漏源电压(Vdss):30V;连续漏极电流(Id):4.2A;导通电阻(RDS(on)):65mΩ@10V,4.2A;耗散功率(Pd):350mW;阈值电压(Vgs(th)):1.3V;; LCSC Part Name: 1个P沟道 耐压:30V 电流:4.2A; Supplier Part: C727156; Manufacturer: TWGMC(迪嘉); Supplier Footprint: SOT-23; JLCPCB Part Class: Extended Part; Datasheet: https://item.szlcsc.com/datasheet/AO3401/774261.html; Supplier: LCSC; Number: 1个P沟道; Drain to Source Voltage: 30V; Current - Continuous Drain(Id): 4.2A; RDS(on): 65mΩ@10V,4.2A; Pd - Power Dissipation: 350mW; Gate Threshold Voltage (Vgs(th)): 1.3V; Input Capacitance(Ciss): 954pF; Reverse Transfer Capacitance (Crss@Vds): 77pF; Operating Temperature: -55℃~+150℃; Type: P沟道; Output Capacitance(Coss): 115pF
R1 R4-R8 R32 R33 R35 = R0603: Supplier Footprint: 0603
R2 = 0603WAF1003T5E: 电阻类型:厚膜电阻;阻值:100kΩ;精度:±1%;功率:100mW;工作电压:75V;温度系数:±100ppm/℃;; LCSC Part Name: 100kΩ ±1% 100mW 厚膜电阻; Supplier Part: C25803; Manufacturer: UNI-ROYAL(厚声); Supplier Footprint: 0603; JLCPCB Part Class: 基础库; Datasheet: https://item.szlcsc.com/datasheet/0603WAF1003T5E/26546.html; Supplier: LCSC; Type: 厚膜电阻; Tolerance: ±1%; Power(Watts): 100mW; Voltage-Supply(Max): 75V; Temperature Coefficient: ±100ppm/℃; Operating Temperature: -55℃~+155℃
R3 = FRC0603F2212TS: 电阻类型:厚膜电阻;阻值:22.1kΩ;精度:±1%;功率:100mW;工作电压:75V;温度系数:±100ppm/℃;; LCSC Part Name: 22.1kΩ ±1% 100mW 厚膜电阻; Supplier Part: C2960862; Manufacturer: FOJAN(富捷); Supplier Footprint: 0603; JLCPCB Part Class: 扩展库; Supplier: LCSC; Type: 厚膜电阻; Tolerance: ±1%; Power(Watts): 100mW; Voltage-Supply(Max): 75V; Temperature Coefficient: ±100ppm/℃; Operating Temperature: -55℃~+155℃
SW1 = SS-12D11G5R: 电路结构:单刀双掷;安装方式:弯插;开关颜色:黑色;额定电流:3A;额定电压:125V;工作寿命:1万次;; LCSC Part Name: 柄长5mm 弯插双档 滑动开关; Supplier Part: C388633; Manufacturer: XKB Connection(中国星坤); Supplier Footprint: 插件; JLCPCB Part Class: Extended Part; Datasheet: https://item.szlcsc.com/datasheet/SS-12D11G5R/363903.html; Supplier: LCSC; Circuit: 单刀双掷; Actuator Style: 矩形柱状; Termination Style: PC引脚; Mounting Type: 弯插; Actuator Color: 黑色; Current Rating: 3A; Voltage Rating: 125V; Life: 1万次; Operating Temperature: -40℃~+85℃
TP4056X1 = TP4056X-42-ESOP8: Supplier Part: C2763448; Manufacturer: TOPPOWER(南京拓微); Supplier Footprint: SOP-8-EP; JLCPCB Part Class: 扩展库; Datasheet: https://atta.szlcsc.com/upload/public/pdf/source/20221111/3D7D53D5011BF4ED4C4D0D9BFDBB1404.pdf; Supplier: LCSC
U2 = SY8089A1AAC: 功能类型:降压型;工作电压:2.5V~5.5V;输出电压:-;输出电流:2A;输出类型:可调;; LCSC Part Name: 高效1.5MHz 2A同步降压调节器; Supplier Part: C479074; Manufacturer: Silergy(矽力杰); Supplier Footprint: SOT-23-5; JLCPCB Part Class: 扩展库; Datasheet: https://item.szlcsc.com/datasheet/SY8089A1AAC/486366.html; Supplier: LCSC; Function: 降压型; Voltage - Supply: 2.5V~5.5V; Output Current: 2A; Frequency - Switching: 1.5MHz; Operating Temperature: -40℃~+125℃@(TA/TJ); Synchronous Rectifier: 是; Number of Outputs: 1; Topology: 降压式; Quiescent Current: 50uA; Switch tube (built-in/external): 内置; Output Type: 可调
C11 = TAJA475K016RNJ: 容值:4.7uF;精度:±10%;额定电压:16V;等效串联电阻(ESR):4Ω@100kHz;; LCSC Part Name: 4.7uF ±10% 16V; Supplier Part: C7187; Manufacturer: Kyocera AVX; Supplier Footprint: CASE-A-3216-18(mm); JLCPCB Part Class: 扩展库; Supplier: LCSC; Tolerance: ±10%; Voltage Rating: 16V; Equivalent Series Resistance(ESR): 4Ω@100kHz; Operating Temperature: -55℃~+125℃
ICM42688P1 = ICM-42688-P: 传感器类型:加速度计陀螺仪;; Supplier Part: C1850418; Manufacturer: TDK InvenSense(应美盛); Supplier Footprint: LGA-14(2.5x3); JLCPCB Part Class: 扩展库; Datasheet: https://atta.szlcsc.com/upload/public/pdf/source/20210703/CF24204867ACE5B754A2B035F23E5931.pdf; Supplier: LCSC; Sensor Type: 加速度计陀螺仪
QMC5883P1 = QMC5883P: QMC5883L停产，推荐使用 C2847467 QMC5883P替代; LCSC Part Name: 三轴磁传感器; Supplier Part: C2847467; Manufacturer: QST(上海矽睿); Supplier Footprint: LGA-16(3x3); JLCPCB Part Class: 扩展库; Datasheet: https://item.szlcsc.com/datasheet/QMC5883P/3044607.html; Supplier: LCSC
RF1 = SMA-KE-P: 连接器类型:板端;接口类型:内孔;端口数量:1;射频系列:SMA;阻抗:50Ω;样式:偏脚;工作温度:-65℃~+165℃;; LCSC Part Name: 内孔 SMA 偏脚; Supplier Part: C49118400; Manufacturer: HanElectricity(瀚源); JLCPCB Part Class: Extended Part; Datasheet: https://item.szlcsc.com/datasheet/SMA-KE-P/51502454.html; Supplier: LCSC; Connector Type: 板端; Interface: 内孔; Number of Ports: 1; RF Series: SMA; Impedance: 50Ω; Style: 偏脚; Rated Voltage (Max): 335V; Operating Temperature Range: -65℃~+165℃
TP1-TP6 = Test-Point: Test Point 测试点
U6 = DX-LR01-433T22S: Supplier Part: C9900235347; Supplier Footprint: SMD; Supplier: LCSC
C18 C19 = CC0603JRNPO9BN220: 容值:22pF;精度:±5%;额定电压:50V;材质(温度系数):NP0;; LCSC Part Name: 22pF ±5% 50V; Supplier Part: C105620; Manufacturer: YAGEO(国巨); Supplier Footprint: 0603; JLCPCB Part Class: 扩展库; Datasheet: https://atta.szlcsc.com/upload/public/pdf/source/20170505/1493957838062.pdf; Supplier: LCSC; Tolerance: ±5%; Voltage Rated: 50V; Temperature Coefficient: NP0
C32 = CL10A105KB8NNNC: 容值:1uF;精度:±10%;额定电压:50V;材质(温度系数):X5R;; LCSC Part Name: 1uF ±10% 50V; Supplier Part: C15849; Manufacturer: SAMSUNG(三星); Supplier Footprint: 0603; JLCPCB Part Class: 基础库; Datasheet: https://atta.szlcsc.com/upload/public/pdf/source/20160218/1457707763339.pdf; Supplier: LCSC; Tolerance: ±10%; Voltage Rated: 50V; Temperature Coefficient: X5R
R10 = 0603WAF1004T5E: 电阻类型:厚膜电阻;阻值:1MΩ;精度:±1%;功率:100mW;最大工作电压:75V;温度系数:±100ppm/℃;; LCSC Part Name: 1MΩ ±1% 100mW 厚膜电阻; Supplier Part: C22935; Manufacturer: UNI-ROYAL(厚声); Supplier Footprint: 0603; JLCPCB Part Class: 基础库; Datasheet: https://atta.szlcsc.com/upload/public/pdf/source/20200306/C422600_1E6D84923E4A46A82E41ADD87F860B5C.pdf; Supplier: LCSC; Type: 厚膜电阻; Tolerance: ±1%; Power(Watts): 100mW; Overload Voltage (Max): 75V; Temperature Coefficient: ±100ppm/℃; Operating Temperature Range: -55℃~+155℃
U5 = BX-XH2.54-4PWZ: 插针结构:1x4P;间距:2.5mm;安装方式:弯插;参考系列:XH;总PIN数:4P;排数:1;每排PIN数:4;行距:-;额定电流:3A;触头材质:黄铜;触头镀层:锡;工作温度:-25℃~+85℃;; LCSC Part Name: 1x4P 间距:2.5mm 弯插 系列:XH; Supplier Part: C18077844; Manufacturer: Bossie(博锡); Supplier Footprint: 弯插,P=2.54mm; JLCPCB Part Class: 扩展库; Datasheet: https://atta.szlcsc.com/upload/public/pdf/source/20231017/05D81E3CC2E19A2382AF41CA37C8F5E7.pdf; Supplier: LCSC; Pins Structure: 1x4P; Pitch: 2.5mm; Mounting Type: 弯插; Reference Series: XH; Number of Pins: 4P; Number of Rows: 1; Number of PINs Per Row: 4; Current Rating: 3A; Contact Material: 黄铜; Contact Plating: 锡; Operating Temperature: -25℃~+85℃; Voltage Rating: 250V; Plastic Material: PA66; Flame Retardant Rating: UL94V-0; Color: 白色; Z-Height of the Board: 5.9mm; X-Length of Bottom Edge on Board (Spacing Line): 12.5mm; Y-Width of Bottom Edge on Board: 7.32mm
U7 = STM32F103RCT6: CPU内核:ARM-M3;CPU最大主频:72MHz;应用领域:-;; LCSC Part Name: 主流增强型ARM Cortex-M3 MCU，具有256 KB Flash、72 MHz CPU、电机控制、USB和CAN; Supplier Part: C8323; Manufacturer: ST(意法半导体); Supplier Footprint: LQFP-64(10x10); JLCPCB Part Class: 扩展库; Datasheet: https://atta.szlcsc.com/upload/public/pdf/source/20180207/C88442_15179953708671359491.pdf; Supplier: LCSC; CPU Core: ARM-M3; CPU Maximum Speed: 72MHz; Program Storage Size: 256KB; Program Memory Type: FLASH; Number of I/O: 51; ADC (Bit): 12bit; DAC (Bit): 12bit; Low Voltage Detection Threshold: 2V~3.6V
X2 = X50328MSB2GI: 晶振类型:贴片晶振;频率:8MHz;常温频差:±10ppm;外接负载电容:20pF;频率稳定度(全温):±20ppm;; LCSC Part Name: 8MHz ±10ppm 20pF YSX530GA; Supplier Part: C115962; Manufacturer: YXC(扬兴晶振); Supplier Footprint: SMD5032; JLCPCB Part Class: 基础库; Datasheet: https://atta.szlcsc.com/upload/public/pdf/source/20240329/44922B0AF7B60E58E9B66993B6077277.pdf; Supplier: LCSC; Crystal Type: 贴片晶振; Normal temperature Frequency Tolerance: ±10ppm; External load capacitor: 20pF; Frequency Stability(Full temperature range): ±20ppm; Operating Temperature: -40℃~+85℃

## Nets
+3.3V: C4.2 C5.2 C7.2 C8.2 C9.2 C10.2 C12.2 C21.2 C22.2 C23.1 C24.1 C30.2 C31.1 C32.1 C33.1 C34.1 C35.1 C36.1 CN1.1 CN2.1 CN3.1 CN4.1 CN5.5 CN6.1 FPC1.6 FPC1.7 FPC1.12 FPC1.33 FPC1.39 FPC1.40 H1.1 H2.1 H3.1 H4.1 H6.1 H7.1 ICM42688P1.5(VDDIO) ICM42688P1.8(VDD) L1.1 L2.1 Q2.3(C) QMC5883P1.2(VDD) R2.2 R4.1 R5.1 R6.1 R7.2 R8.2 R16.1 R17.1 R21.1 R28.2 U1.2(3V3) U3.5(VCC) U3.8(V3) U6.15(VBAT) U6.22(RSTN) U7.1(VBAT) U7.13(VDDA) U7.19(VDD_4) U7.32(VDD_1) U7.48(VDD_2) U7.64(VDD_3) U8.1(+)
GND: C1.1 C2.1 C3.2 C5.1 C6.1 C7.1 C8.1 C9.1 C10.1 C11.2 C12.1 C13.2 C14.1 C15.1 C16.1 C18.1 C19.1 C21.1 C22.1 C23.2 C24.2 C25.2 C26.2 C29.2 C30.1 C31.2 C32.2 C33.2 C34.2 C35.2 C36.2 CN1.3 CN2.3 CN3.3 CN4.3 CN5.2 CN5.4 CN6.2 CN6.4 CN7.1(GND) CN7.10(GND) CN7.12(GND) CN8.1 CN10.2 CN11.2 CN12.2 CN13.2 D1.2(GND) D2.2(GND) FPC1.5 FPC1.16 FPC1.17 FPC1.18 FPC1.19 FPC1.20 FPC1.21 FPC1.22 FPC1.23 FPC1.24 FPC1.25 FPC1.26 FPC1.27 FPC1.28 FPC1.29 FPC1.30 FPC1.31 FPC1.32 FPC1.37 FPC1.38 H1.4 H2.4 H3.6 H4.6 H5.3 H6.3 H7.3 H8.3 H9.3 ICM42688P1.2(RESV) ICM42688P1.3(RESV) ICM42688P1.6(GND) ICM42688P1.7(RESV) ICM42688P1.10(RESV) ICM42688P1.11(RESV) Q1.2(E) QMC5883P1.9(GND) QMC5883P1.11(GND) R1.1 R3.1 R9.2 R11.2 R12.2 R15.1 R18.2 R20.1 R22.2 R23.1 R24.2 R25.1 R30.1 R33.1 R35.1 RF1.1 RF1.2 RF1.3 RF1.4 SW2.2 SW3.2 SW4.2 TP4056X1.1(TEMP) TP4056X1.3(GND) TP4056X1.9(EP) U1.1(GND) U1.40(GND) U1.41(GND) U2.2(GND) U3.3(GND) U4.2 U4.3 U5.3 U6.14(GND) U6.28(GND) U6.30(GND) U7.12(VSSA) U7.18(VSS_4) U7.31(VSS_1) U7.47(VSS_2) U7.63(VSS_3) USB1.A1(GND) USB1.A12(GND) USB1.B1(GND) USB1.B12(GND) USB2.A1(GND) USB2.A12(GND) USB2.B1(GND) USB2.B12(GND)
1PPS: CN7.4(1PPS) R31.1
ADC_BAT: R32.1 R33.2 U7.25(PC5)
BAT+: C3.1 CN8.2 Q4.3(D) TP4056X1.5(BAT)
CHRG: R26.1 TP4056X1.7(CHRG#)
DEBUG_RX: U5.4 U7.53(PC12)
ENCODER_1_A: CN6.3 U7.15(PA1)
ENCODER_1_B: CN6.5 U7.14(PA0-WKUP)
ENCODER_2_A: CN5.3 U7.37(PC6)
ENCODER_2_B: CN5.1 U7.38(PC7)
ESP32_BOOT: C25.1 R16.2 SW2.1 U1.27(IO0)
ESP32_RESET: C26.1 FPC1.15 R17.2 SW3.1 U1.3(EN)
ESP32_RX: U1.36(RXD0) U3.6(TXD)
ESP32_TX: U1.37(TXD0) U3.7(RXD)
ESP32_UART1_RX: H5.2 U1.10(IO17) U7.16(PA2)
ESP32_UART1_TX: H5.1 U1.11(IO18) U7.17(PA3)
ESP32_USB_D+: D2.3(I/O2) U3.1(UD+)
ESP32_USB_D+_IN: D2.4(I/O2) USB2.A6(DP1) USB2.B6(DP2)
ESP32_USB_D-: D2.1(I/O1) U3.2(UD-)
ESP32_USB_D-_IN: D2.6(I/O1) USB2.A7(DN1) USB2.B7(DN2)
FULL: R27.1 TP4056X1.6(STDBY#)
GPS_RX: CN7.3(RXD0) H9.2 U7.51(PC10)
GPS_TX: CN7.2(TXD0) H9.1 U7.52(PC11)
ICM42688P_CS: ICM42688P1.12(AP_CS) TP4.1 U7.20(PA4)
ICM42688P_IRQ: ICM42688P1.4(INT1/INT) U7.24(PC4)
ICM42688P_MISO: ICM42688P1.1(AP_SDO/AP_AD0) R4.2 TP1.1 U7.22(PA6)
ICM42688P_MOSI: ICM42688P1.14(AP_SDA/AP_SDIO/AP_SDI) R5.2 TP2.1 U7.23(PA7)
ICM42688P_SCK: ICM42688P1.13(AP_SCL/AP_SCLK) R6.2 TP3.1 U7.21(PA5)
LCD_CS: FPC1.9 U1.18(IO10)
LCD_DC: FPC1.11 U1.17(IO9)
LCD_LED: R14.1 U1.22(IO14)
LCD_SCK: FPC1.10 U1.20(IO12)
LCD_SDA: FPC1.13 U1.19(IO11)
LCD_SDO: FPC1.14 U1.21(IO13)
LEFT_BT_1: H4.2 U7.55(PB3)
LEFT_BT_2: H4.3 U7.56(PB4)
LEFT_BT_3: H4.4 U7.57(PB5)
LEFT_BT_4: H4.5 U7.58(PB6)
LEFT_CT_H: CN2.2 U7.27(PB1)
LEFT_CT_V: CN1.2 U7.26(PB0)
LORA_RX: H8.1 U6.21(UART-RX) U7.42(PA9)
LORA_TX: H8.2 U6.2(UART-TX) U7.43(PA10)
M0: H6.2 U6.5(M0)
M1: H7.2 U6.7(M1)
NRST: C29.1 R21.2 SW4.1 U7.7(NRST)
OSC8_IN: C19.2 R10.2 U7.5(PD0-OSC_IN) X2.2(OSC2)
OSC8_OUT: C18.2 R10.1 U7.6(PD1-OSC_OUT) X2.1(OSC1)
QMC5883P_SCL: QMC5883P1.1(SCK) R8.1 TP5.1 U7.29(PB10)
QMC5883P_SDA: QMC5883P1.16(SDA) R7.1 TP6.1 U7.30(PB11)
RF_IN: CN7.11(RF_IN) R29.1
RIGHT_BT_1: H3.2 U7.2(PC13-TAMPER-RTC)
RIGHT_BT_2: H3.3 U7.62(PB9)
RIGHT_BT_3: H3.4 U7.61(PB8)
RIGHT_BT_4: H3.5 U7.59(PB7)
RIGHT_CT_H: CN3.2 U7.8(PC0)
RIGHT_CT_V: CN4.2 U7.9(PC1)
SIDE_BT_1: H2.2 U7.10(PC2)
SIDE_BT_2: H2.3 U7.11(PC3)
SIDE_BT_3: H1.3 U7.33(PB12)
SIDE_BT_4: H1.2 U7.34(PB13)
STM32_USB_DM: D1.3(I/O2) U7.44(PA11)
STM32_USB_DM_IN: D1.4(I/O2) USB1.A7(DN1) USB1.B7(DN2)
STM32_USB_DP: D1.1(I/O1) U7.45(PA12)
STM32_USB_DP_IN: D1.6(I/O1) USB1.A6(DP1) USB1.B6(DP2)
SWCLK: U5.2 U7.49(PA14)
SWDIO: U5.1 U7.46(PA13)
TRIGGER_1: CN10.1 U7.35(PB14)
TRIGGER_2: CN13.1 U7.36(PB15)
TRIGGER_3: CN11.1 U7.3(PC14-OSC32_IN)
TRIGGER_4: CN12.1 U7.4(PC15-OSC32_OUT)
UART5_RX: U7.54(PD2)
VUSB: C1.2 C2.2 CHRG1.2(A) D1.5(VBUS) D2.5(VBUS) D3.2(A) FULL1.2(A) Q4.1(G) R35.2 TP4056X1.4(VCC) TP4056X1.8(CE) USB1.A4(VBUS) USB1.A9(VBUS) USB1.B4(VBUS) USB1.B9(VBUS) USB2.A4(VBUS) USB2.A9(VBUS) USB2.B4(VBUS) USB2.B9(VBUS)
$1N5: Q1.1(B) R14.2 R15.2
$1N7: FPC1.34 FPC1.35 FPC1.36 R13.2
$1N8: Q1.3(C) R13.1
$1N74: R12.1 USB2.B5(CC2)
$1N75: R18.1 USB2.A5(CC1)
$2N3: R1.2 TP4056X1.2(PROG)
$2N16: C4.1 R2.1 R3.2 U2.5(FB)
$2N18: L1.2 U2.3(LX)
$2N32: D3.1(C) Q4.2(S) SW1.3
$2N33: C6.2 C16.2 R32.2 SW1.2 U2.1(EN) U2.4(IN)
$2N36: CHRG1.1(C) R26.2
$3N20: C11.1 QMC5883P1.10(C1)
$3N33: RF1.5 U6.29(ANT)
$5N75: R23.2 U7.28(PB2)
$5N79: R22.1 U7.60(BOOT0)
$5N93: R24.1 U8.2(-)
$5N113: R9.1 USB1.B5(CC2)
$5N114: R11.1 USB1.A5(CC1)
$6N5: CN7.5(ON/OFF) CN7.9(nRESET) R28.1
$6N9: C13.1 CN7.6(VBAT)
$6N11: C14.2 C15.2 CN7.8(VCC) L2.2
$6N15: R19.1 R20.2 R29.2
$6N18: R19.2 R25.2 U4.1
$6N21: Q2.1(B) R31.2
$6N23: Q2.2(E) U9.1(+)
$6N24: R30.2 U9.2(-)
Net-(FULL1-1): FULL1.1(C) R27.2

Not connected (* = marked no-connect by the designer): CN7 7(Reserved)* 13(Reserved)* 14(VCC_RF)* 15(Reserved)* 16(RXD1)* 17(TXD1)* 18(Reserved)*; FPC1 1* 2* 3* 4* 8* 41* 42*; ICM42688P1 9(INT2/FSYNC/CLKIN)*; QMC5883P1 3(NC)* 4(NC)* 5(NC)* 6(NC)* 7(NC)* 8(NC)* 12(NC)* 13(NC)* 14(NC)* 15(NC)*; SW1 1* 4* 5*; U1 4(IO4) 5(IO5) 6(IO6) 7(IO7) 8(IO15) 9(IO16) 12(IO8) 13(IO19) 14(IO20) 15(IO3) 16(IO46) 23(IO21) 24(IO47) 25(IO48) 26(IO45) 28(IO35)* 29(IO36)* 30(IO37)* 31(IO38) 32(IO39) 33(IO40) 34(IO41) 35(IO42) 38(IO2) 39(IO1); U3 4(RTS#)*; U6 1(GPIO09)* 3(GPIO45)* 4(GPIO44)* 6(GPIO33)* 8(WORK-STATUS)* 9(GPIO00)* 10(AUX)* 11(GPIO02)* 12(GPIO06)* 13(GPIO07)* 16(GPIO16)* 17(GPIO17)* 18(GPIO14)* 19(GPIO15)* 20(GPIO62)* 23(GPIO58)* 24(GPIO11)* 25(GPIO08)* 26(GPIO05)* 27(GPIO04)* 31(EP)*; U7 39(PC8)* 40(PC9)* 41(PA8)* 50(PA15)*; USB1 1(EP)* 2(EP)* 3(EP)* 4(EP)* A8(SBU1)* B8(SBU2)*; USB2 1(EP)* 2(EP)* 3(EP)* 4(EP)* A8(SBU1)* B8(SBU2)*

## Notes on the sheets
sheet 4
- 如果启动不了可以尝试连接该0欧电阻
  并将10k欧电阻去掉
- 保证PCB走线50欧姆阻抗
- 对于ATGM336H,只需隔直电容+无缘天线;不需要焊接并联的两个0欧电阻
  对于ATGM332D,只需要pi型网络＋无缘天线
sheet 5
- Vout=0.6*(1+Rh/Rl)=3.3V
sheet 6
- 4+4+2+2+4=16按钮
  2个编码器
  4个ADC
